# EAGLE schematic CTT-20190123 (EAGLE 6.6.0), part 1 of 2

## Sheet 1 of 12
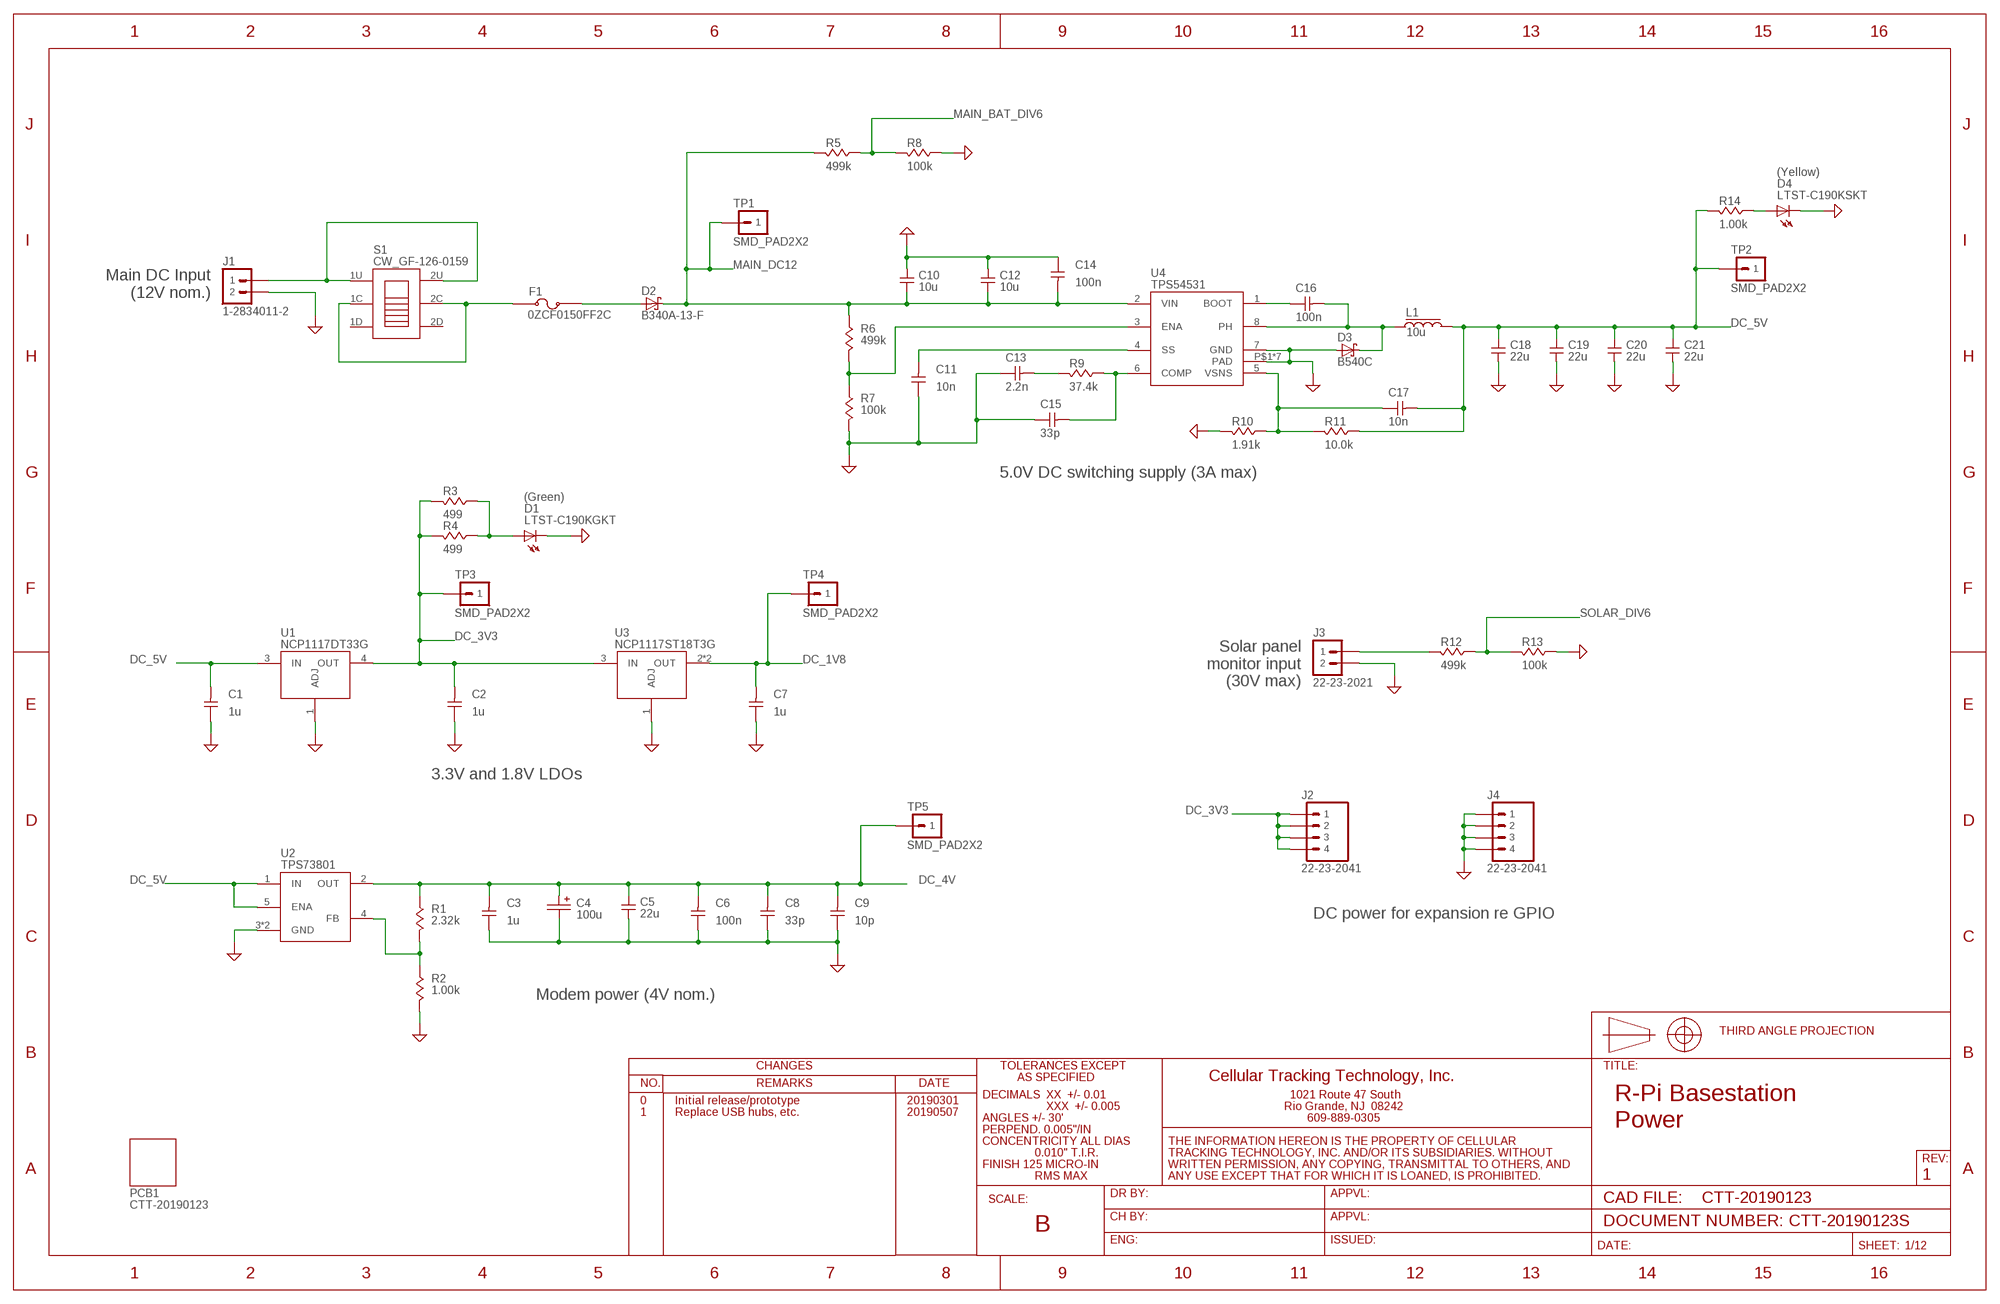
[diagram p0: schematic, sheet 1]

### Parts
C1  1u  C0603_IPC7351_MED  [C0603_IPC7351_MED]
C2  1u  C0603_IPC7351_MED  [C0603_IPC7351_MED]
C3  1u  C0603_IPC7351_MED  [C0603_IPC7351_MED]
C4  100u  CAP7343  [C7343]
C5  22u  C0805  [C0805]
C6  100n  C0402IPC_MED  [C0402_IPC7351_MED]
C7  1u  C0603_IPC7351_MED  [C0603_IPC7351_MED]
C8  33p  C0402IPC_MED  [C0402_IPC7351_MED]
C9  10p  C0402IPC_MED  [C0402_IPC7351_MED]
C10  10u  C0805  [C0805]
C11  10n  C0402IPC_MED  [C0402_IPC7351_MED]
C12  10u  C0805  [C0805]
C13  2.2n  C0402IPC_MED  [C0402_IPC7351_MED]
C14  100n  C0402IPC_MED  [C0402_IPC7351_MED]
C15  33p  C0402IPC_MED  [C0402_IPC7351_MED]
C16  100n  C0402IPC_MED  [C0402_IPC7351_MED]
C17  10n  C0402IPC_MED  [C0402_IPC7351_MED]
C18  22u  C0805  [C0805]
C19  22u  C0805  [C0805]
C20  22u  C0805  [C0805]
C21  22u  C0805  [C0805]
D1  LTST-C190KGKT  LTST-C190GKT  [LED0603]
D2  B340A-13-F  [SMA]
D3  B540C  [SMC]
D4  LTST-C190KSKT  LTST-C190GKT  [LED0603]
F1  0ZCF0150FF2C  [SMD2920_0ZCF-SERIES]
J1  1-2834011-2  [1-2834011-2]
J2  22-23-2041  640456-4  [MTA100-4]
J3  22-23-2021  640456-2  [MTA100-2]
J4  22-23-2041  640456-4  [MTA100-4]
L1  10u  SRR1260  [SRR1260]
PCB1  CTT-20190123  PCBBRD  [BLANK_BRD]
R1  2.32k  R0402MED  [R0402_IPC7351_MED]
R2  1.00k  R0402MED  [R0402_IPC7351_MED]
R3  499  R0402MED  [R0402_IPC7351_MED]
R4  499  R0402MED  [R0402_IPC7351_MED]
R5  499k  R0402MED  [R0402_IPC7351_MED]
R6  499k  R0402MED  [R0402_IPC7351_MED]
R7  100k  R0402MED  [R0402_IPC7351_MED]
R8  100k  R0402MED  [R0402_IPC7351_MED]
R9  37.4k  R0402MED  [R0402_IPC7351_MED]
R10  1.91k  R0402MED  [R0402_IPC7351_MED]
R11  10.0k  R0402MED  [R0402_IPC7351_MED]
R12  499k  R0402MED  [R0402_IPC7351_MED]
R13  100k  R0402MED  [R0402_IPC7351_MED]
R14  1.00k  R0402MED  [R0402_IPC7351_MED]
S1  CW_GF-126-0159  [CW_GF-126-0159]
TP1  SMD_PAD2X2  [SMD_PAD]
TP2  SMD_PAD2X2  [SMD_PAD]
TP3  SMD_PAD2X2  [SMD_PAD]
TP4  SMD_PAD2X2  [SMD_PAD]
TP5  SMD_PAD2X2  [SMD_PAD]
U1  NCP1117DT33G  [DPAK]
U2  TPS73801  [TI_R-PDSO-G6]
U3  NCP1117ST18T3G  [SOT-223]
U4  TPS54531  [TI_R-PDSO-G8]

### Nets
DC_1V8: C7.P$2 TP4.1 U3.2(OUT) U3.4(OUT) ; also sheet 2,4
DC_3V3: C2.P$2 J2.1 J2.2 J2.3 J2.4 R3.P$2 R4.P$2 TP3.1 U1.4(OUT) U3.3(IN) ; also sheet 2,3,4,5,6,7,8,9,10,11,12
DC_4V: C3.P$2 C4.+(POS) C5.2 C6.P$2 C8.P$2 C9.P$2 R1.P$1 TP5.1 U2.2(OUT) ; also sheet 7
DC_5V: C1.P$2 C17.P$2 C18.2 C19.2 C20.2 C21.2 L1.2 R11.P$1 R14.P$2 TP2.1 U1.3(IN) U2.1(IN) U2.5(ENA) ; also sheet 2,3,4,5,7,8,9,10,11,12
GND: C1.P$1 C2.P$1 C3.P$1 C4.-(NEG) C5.1 C6.P$1 C7.P$1 C8.P$1 C9.P$1 C10.1 C11.P$1 C12.1 C13.P$1 C14.P$1 C15.P$1 C18.1 C19.1 C20.1 C21.1 D1.K D3.A D4.K J1.2 J3.2 J4.1 J4.2 J4.3 J4.4 R2.P$2 R7.P$2 R8.P$1 R10.P$2 R13.P$1 U1.1(ADJ) U2.3(GND) U2.TAB(GND) U3.1(ADJ) U4.7(GND) U4.P$1(PAD) U4.P$2(PAD) U4.P$3(PAD) U4.P$4(PAD) U4.P$5(PAD) U4.P$6(PAD) U4.PAD ; also sheet 2,3,4,5,6,7,8,9,10,11,12
MAIN_BAT_DIV6: R5.P$1 R8.P$2 ; also sheet 3
MAIN_DC12: C10.2 C12.2 C14.P$2 D2.C R5.P$2 R6.P$1 TP1.1 U4.2(VIN)
N$1: C16.P$2 D3.K(C) L1.P$1 U4.8(PH)
N$2: R6.P$2 R7.P$1 U4.3(ENA)
N$4: C11.P$2 U4.4(SS)
N$6: C16.P$1 U4.1(BOOT)
N$7: C15.P$2 R9.P$1 U4.6(COMP)
N$8: C17.P$1 R10.P$1 R11.P$2 U4.5(VSNS)
N$9: C13.P$2 R9.P$2
N$10: J1.1 S1.1U S1.2U
N$11: D2.A F1.P$2
N$13: D4.A R14.P$1
N$14: D1.A R3.P$1 R4.P$1
N$21: R1.P$2 R2.P$1 U2.4(FB)
N$116: J3.1 R12.P$2
N$213: F1.P$1 S1.1C S1.2C
SOLAR_DIV6: R12.P$1 R13.P$2 ; also sheet 3
Unconnected: S1.1D S1.2D

### Notes on the sheet
- (Yellow)
- Main DC Input
  (12V nom.)
- 5.0V DC switching supply (3A max)
- (Green)
- Solar panel
  monitor input
  (30V max)
- 3.3V and 1.8V LDOs
- DC power for expansion re GPIO
- Modem power (4V nom.)
- 0 | Initial release/prototype | 20190301
- 1 | Replace USB hubs, etc. | 20190507
- R-Pi Basestation
  Power
- 1
- CTT-20190123S

## Sheet 2 of 12
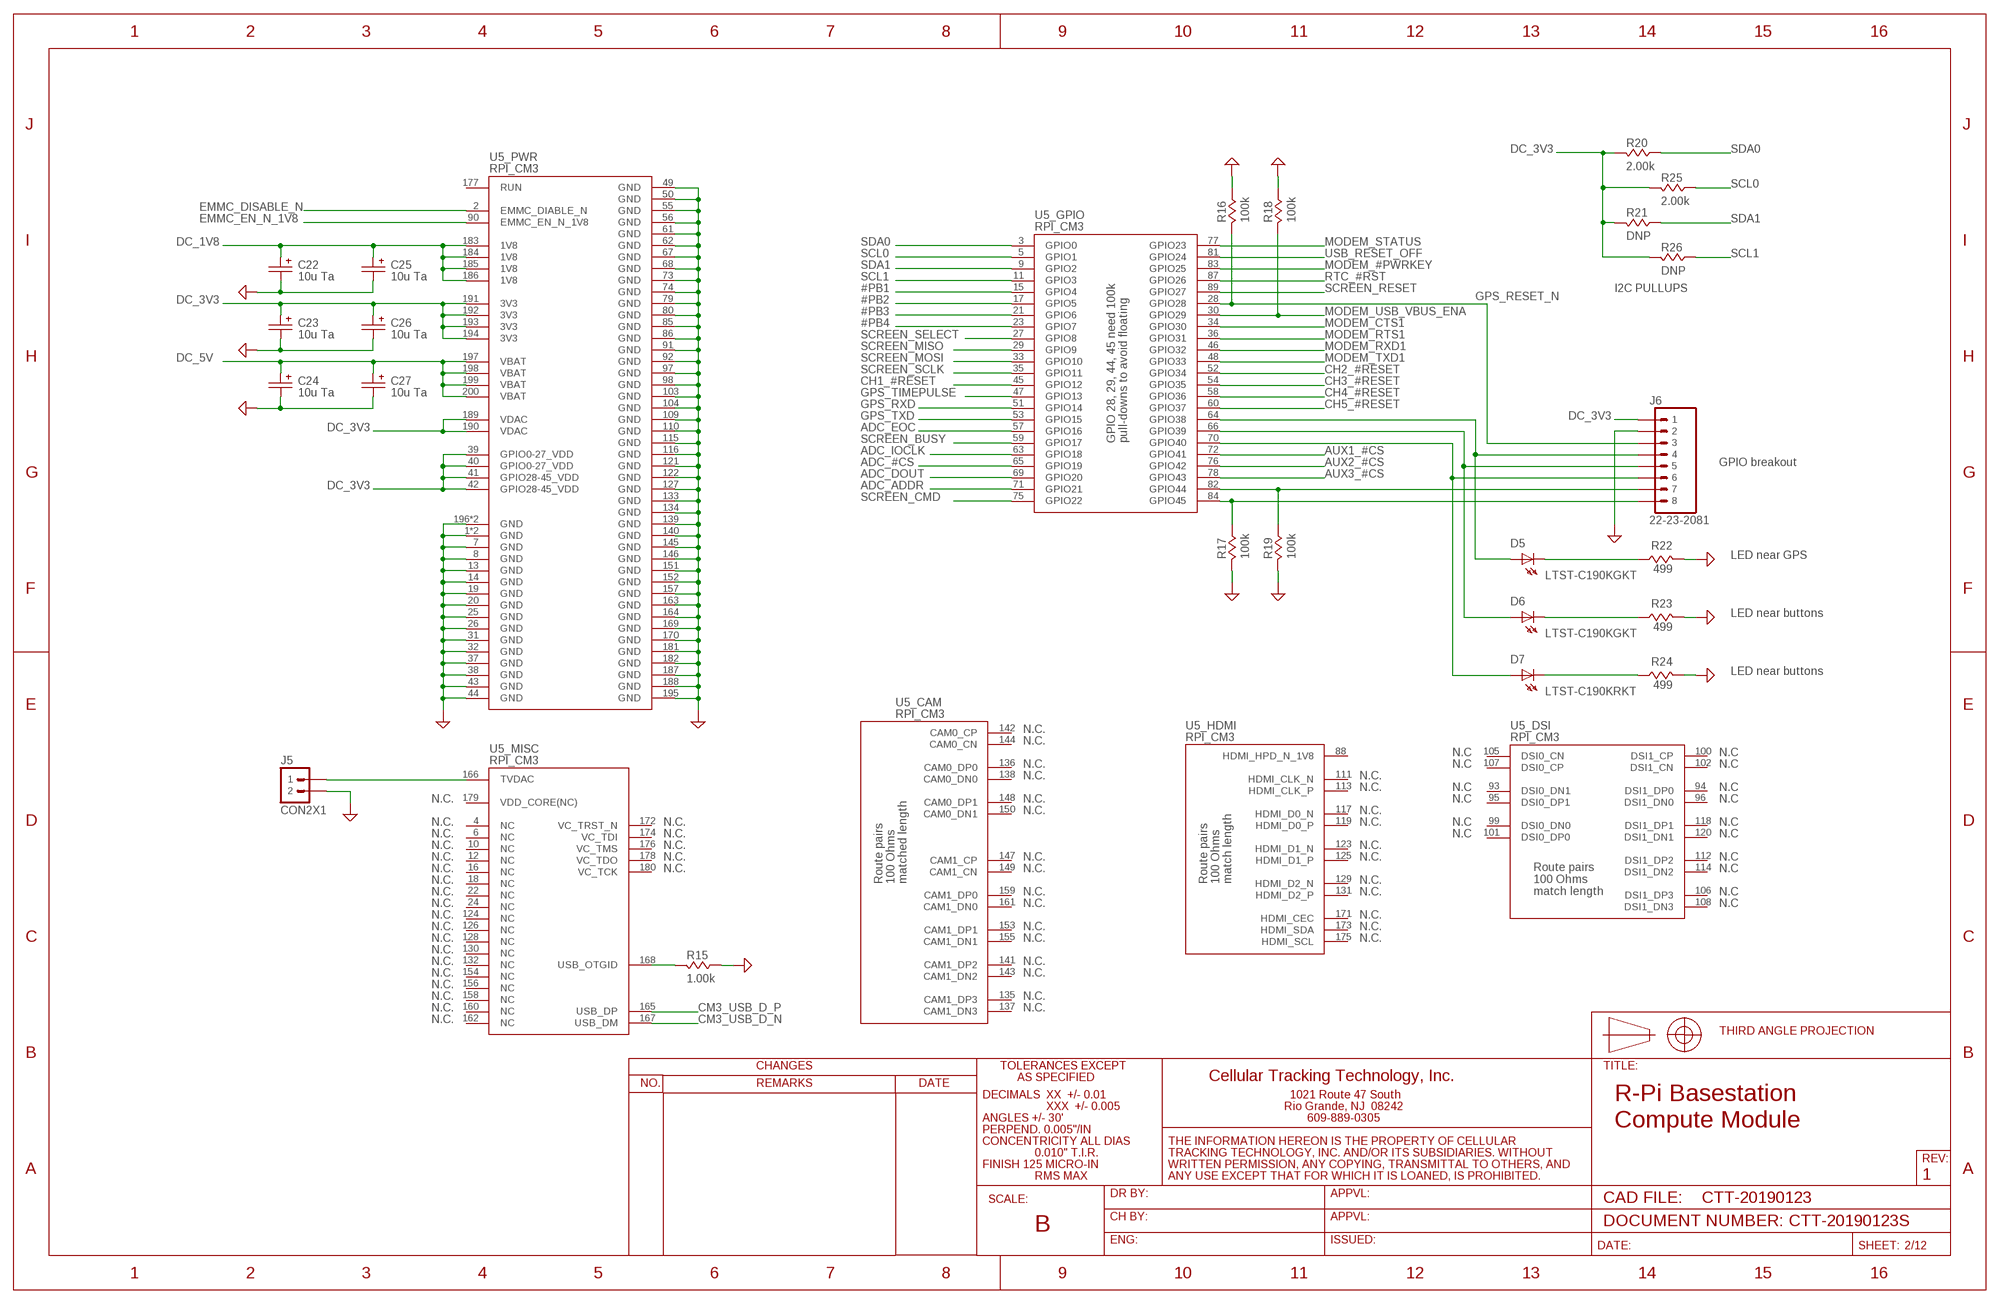
[diagram p1: schematic, sheet 2]

### Parts
C22  10u Ta  CAP1411-AVX  [CAP1411-AVX_F97SERIES]
C23  10u Ta  CAP1411-AVX  [CAP1411-AVX_F97SERIES]
C24  10u Ta  CAP1411-AVX  [CAP1411-AVX_F97SERIES]
C25  10u Ta  CAP1411-AVX  [CAP1411-AVX_F97SERIES]
C26  10u Ta  CAP1411-AVX  [CAP1411-AVX_F97SERIES]
C27  10u Ta  CAP1411-AVX  [CAP1411-AVX_F97SERIES]
D5  LTST-C190KGKT  LTST-C190GKT  [LED0603]
D6  LTST-C190KGKT  LTST-C190GKT  [LED0603]
D7  LTST-C190KRKT  LTST-C190GKT  [LED0603]
J5  CON2X1  [CON2X1]
J6  22-23-2081  640456-8  [MTA100-8]
R15  1.00k  R0402MED  [R0402_IPC7351_MED]
R16  100k  R0402MED  [R0402_IPC7351_MED]
R17  100k  R0402MED  [R0402_IPC7351_MED]
R18  100k  R0402MED  [R0402_IPC7351_MED]
R19  100k  R0402MED  [R0402_IPC7351_MED]
R20  2.00k  R0402MED  [R0402_IPC7351_MED]
R21  DNP  R0402MED  [R0402_IPC7351_MED]
R22  499  R0402MED  [R0402_IPC7351_MED]
R23  499  R0402MED  [R0402_IPC7351_MED]
R24  499  R0402MED  [R0402_IPC7351_MED]
R25  2.00k  R0402MED  [R0402_IPC7351_MED]
R26  DNP  R0402MED  [R0402_IPC7351_MED]
U5  RPI_CM3  [1473149-4]

### Nets
#PB1: U5.15(_GPIO:GPIO4) ; also sheet 3
#PB2: U5.17(_GPIO:GPIO5) ; also sheet 3
#PB3: U5.21(_GPIO:GPIO6) ; also sheet 3
#PB4: U5.23(_GPIO:GPIO7) ; also sheet 3
ADC_#CS: U5.65(_GPIO:GPIO19) ; also sheet 3
ADC_ADDR: U5.71(_GPIO:GPIO21) ; also sheet 3
ADC_DOUT: U5.69(_GPIO:GPIO20) ; also sheet 3
ADC_EOC: U5.57(_GPIO:GPIO16) ; also sheet 3
ADC_IOCLK: U5.63(_GPIO:GPIO18) ; also sheet 3
AUX1_#CS: U5.72(_GPIO:GPIO41) ; also sheet 3
AUX2_#CS: U5.76(_GPIO:GPIO42) ; also sheet 3
AUX3_#CS: U5.78(_GPIO:GPIO43) ; also sheet 3
CH1_#RESET: U5.45(_GPIO:GPIO12) ; also sheet 8
CH2_#RESET: U5.52(_GPIO:GPIO34) ; also sheet 9
CH3_#RESET: U5.54(_GPIO:GPIO35) ; also sheet 10
CH4_#RESET: U5.58(_GPIO:GPIO36) ; also sheet 11
CH5_#RESET: U5.60(_GPIO:GPIO37) ; also sheet 12
CM3_USB_D_N [USB]: U5.167(_MISC:USB_DM) ; also sheet 4
CM3_USB_D_P [USB]: U5.165(_MISC:USB_DP) ; also sheet 4
DC_1V8: C22.+(POS) C25.+(POS) U5.183(_PWR:1V8) U5.184(_PWR:1V8) U5.185(_PWR:1V8) U5.186(_PWR:1V8) ; also sheet 1,4
DC_3V3: C23.+(POS) C26.+(POS) J6.1 R20.P$2 R21.P$2 R25.P$2 R26.P$2 U5.39(_PWR:GPIO0-27_VDD) U5.40(_PWR:GPIO0-27_VDD) U5.41(_PWR:GPIO28-45_VDD) U5.42(_PWR:GPIO28-45_VDD) U5.189(_PWR:VDAC) U5.190(_PWR:VDAC) U5.191(_PWR:3V3) U5.192(_PWR:3V3) U5.193(_PWR:3V3) U5.194(_PWR:3V3) ; also sheet 1,3,4,5,6,7,8,9,10,11,12
DC_5V: C24.+(POS) C27.+(POS) U5.197(_PWR:VBAT) U5.198(_PWR:VBAT) U5.199(_PWR:VBAT) U5.200(_PWR:VBAT) ; also sheet 1,3,4,5,7,8,9,10,11,12
EMMC_DISABLE_N: U5.2(_PWR:EMMC_DIABLE_N) ; also sheet 4
EMMC_EN_N_1V8: U5.90(_PWR:EMMC_EN_N_1V8) ; also sheet 4
GND: C22.-(NEG) C23.-(NEG) C24.-(NEG) C25.-(NEG) C26.-(NEG) C27.-(NEG) J5.2 J6.2 R15.P$1 R16.P$1 R17.P$2 R18.P$1 R19.P$2 R22.P$2 R23.P$2 R24.P$2 U5.1(_PWR:GND) U5.7(_PWR:GND) U5.8(_PWR:GND) U5.13(_PWR:GND) U5.14(_PWR:GND) U5.19(_PWR:GND) U5.20(_PWR:GND) U5.25(_PWR:GND) U5.26(_PWR:GND) U5.31(_PWR:GND) U5.32(_PWR:GND) U5.37(_PWR:GND) U5.38(_PWR:GND) U5.43(_PWR:GND) U5.44(_PWR:GND) U5.49(_PWR:GND) U5.50(_PWR:GND) U5.55(_PWR:GND) U5.56(_PWR:GND) U5.61(_PWR:GND) U5.62(_PWR:GND) U5.67(_PWR:GND) U5.68(_PWR:GND) U5.73(_PWR:GND) U5.74(_PWR:GND) U5.79(_PWR:GND) U5.80(_PWR:GND) U5.85(_PWR:GND) U5.86(_PWR:GND) U5.91(_PWR:GND) U5.92(_PWR:GND) U5.97(_PWR:GND) U5.98(_PWR:GND) U5.103(_PWR:GND) U5.104(_PWR:GND) U5.109(_PWR:GND) U5.110(_PWR:GND) U5.115(_PWR:GND) U5.116(_PWR:GND) U5.121(_PWR:GND) U5.122(_PWR:GND) U5.127(_PWR:GND) U5.133(_PWR:GND) U5.134(_PWR:GND) U5.139(_PWR:GND) U5.140(_PWR:GND) U5.145(_PWR:GND) U5.146(_PWR:GND) U5.151(_PWR:GND) U5.152(_PWR:GND) U5.157(_PWR:GND) U5.163(_PWR:GND) U5.164(_PWR:GND) U5.169(_PWR:GND) U5.170(_PWR:GND) U5.181(_PWR:GND) U5.182(_PWR:GND) U5.187(_PWR:GND) U5.188(_PWR:GND) U5.195(_PWR:GND) U5.196(_PWR:GND) U5.P$1(_PWR:GND) U5.P$2(_PWR:GND) ; also sheet 1,3,4,5,6,7,8,9,10,11,12
GPS_RESET_N: J6.3 R16.P$2 U5.28(_GPIO:GPIO28) ; also sheet 3
GPS_RXD: U5.51(_GPIO:GPIO14) ; also sheet 3
GPS_TIMEPULSE: U5.47(_GPIO:GPIO13) ; also sheet 3
GPS_TXD: U5.53(_GPIO:GPIO15) ; also sheet 3
MODEM_#PWRKEY: U5.83(_GPIO:GPIO25) ; also sheet 3,7
MODEM_CTS1: U5.34(_GPIO:GPIO30) ; also sheet 7
MODEM_RTS1: U5.36(_GPIO:GPIO31) ; also sheet 7
MODEM_RXD1: U5.46(_GPIO:GPIO32) ; also sheet 7
MODEM_STATUS: U5.77(_GPIO:GPIO23) ; also sheet 7
MODEM_TXD1: U5.48(_GPIO:GPIO33) ; also sheet 7
MODEM_USB_VBUS_ENA: R18.P$2 U5.30(_GPIO:GPIO29) ; also sheet 7
N$15: J5.1 U5.166(_MISC:TVDAC)
N$16: R15.P$2 U5.168(_MISC:USB_OTGID)
N$108: J6.8 R17.P$1 U5.84(_GPIO:GPIO45)
N$110: J6.7 R19.P$1 U5.82(_GPIO:GPIO44)
N$168: D5.A J6.4 U5.64(_GPIO:GPIO38)
N$169: D6.A J6.5 U5.66(_GPIO:GPIO39)
N$170: D7.A J6.6 U5.70(_GPIO:GPIO40)
N$222: D6.K R23.P$1
N$224: D7.K R24.P$1
N$239: D5.K R22.P$1
RTC_#RST: U5.87(_GPIO:GPIO26) ; also sheet 3
SCL0: R25.P$1 U5.5(_GPIO:GPIO1) ; also sheet 3
SCL1: R26.P$1 U5.11(_GPIO:GPIO3) ; also sheet 3
SCREEN_BUSY: U5.59(_GPIO:GPIO17) ; also sheet 3
SCREEN_CMD: U5.75(_GPIO:GPIO22) ; also sheet 3
SCREEN_MISO: U5.29(_GPIO:GPIO9) ; also sheet 3
SCREEN_MOSI: U5.33(_GPIO:GPIO10) ; also sheet 3
SCREEN_RESET: U5.89(_GPIO:GPIO27) ; also sheet 3
SCREEN_SCLK: U5.35(_GPIO:GPIO11) ; also sheet 3
SCREEN_SELECT: U5.27(_GPIO:GPIO8) ; also sheet 3
SDA0: R20.P$1 U5.3(_GPIO:GPIO0) ; also sheet 3
SDA1: R21.P$1 U5.9(_GPIO:GPIO2) ; also sheet 3
USB_RESET_OFF: U5.81(_GPIO:GPIO24) ; also sheet 4
Unconnected: U5.4(_MISC:NC) U5.6(_MISC:NC) U5.10(_MISC:NC) U5.12(_MISC:NC) U5.16(_MISC:NC) U5.18(_MISC:NC) U5.22(_MISC:NC) U5.24(_MISC:NC) U5.88(_HDMI:HDMI_HPD_N_1V8) U5.93(_DSI:DSI0_DN1) U5.94(_DSI:DSI1_DP0) U5.95(_DSI:DSI0_DP1) U5.96(_DSI:DSI1_DN0) U5.99(_DSI:DSI0_DN0) U5.100(_DSI:DSI1_CP) U5.101(_DSI:DSI0_DP0) U5.102(_DSI:DSI1_CN) U5.105(_DSI:DSI0_CN) U5.106(_DSI:DSI1_DP3) U5.107(_DSI:DSI0_CP) U5.108(_DSI:DSI1_DN3) U5.111(_HDMI:HDMI_CLK_N) U5.112(_DSI:DSI1_DP2) U5.113(_HDMI:HDMI_CLK_P) U5.114(_DSI:DSI1_DN2) U5.117(_HDMI:HDMI_D0_N) U5.118(_DSI:DSI1_DP1) U5.119(_HDMI:HDMI_D0_P) U5.120(_DSI:DSI1_DN1) U5.123(_HDMI:HDMI_D1_N) U5.124(_MISC:NC) U5.125(_HDMI:HDMI_D1_P) U5.126(_MISC:NC) U5.128(_MISC:NC) U5.129(_HDMI:HDMI_D2_N) U5.130(_MISC:NC) U5.131(_HDMI:HDMI_D2_P) U5.132(_MISC:NC) U5.135(_CAM:CAM1_DP3) U5.136(_CAM:CAM0_DP0) U5.137(_CAM:CAM1_DN3) U5.138(_CAM:CAM0_DN0) U5.141(_CAM:CAM1_DP2) U5.142(_CAM:CAM0_CP) U5.143(_CAM:CAM1_DN2) U5.144(_CAM:CAM0_CN) U5.147(_CAM:CAM1_CP) U5.148(_CAM:CAM0_DP1) U5.149(_CAM:CAM1_CN) U5.150(_CAM:CAM0_DN1) U5.153(_CAM:CAM1_DP1) U5.154(_MISC:NC) U5.155(_CAM:CAM1_DN1) U5.156(_MISC:NC) U5.158(_MISC:NC) U5.159(_CAM:CAM1_DP0) U5.160(_MISC:NC) U5.161(_CAM:CAM1_DN0) U5.162(_MISC:NC) U5.171(_HDMI:HDMI_CEC) U5.172(_MISC:VC_TRST_N) U5.173(_HDMI:HDMI_SDA) U5.174(_MISC:VC_TDI) U5.175(_HDMI:HDMI_SCL) U5.176(_MISC:VC_TMS) U5.177(_PWR:RUN) U5.178(_MISC:VC_TDO) U5.179(_MISC:VDD_CORE(NC)) U5.180(_MISC:VC_TCK)

### Notes on the sheet
- I2C PULLUPS
- GPIO breakout
- LED near GPS
- LED near buttons
- LED near buttons
- N.C.
- N.C.
- N.C | N.C
- N.C. | N.C | N.C
- N.C. | N.C.
- N.C. | N.C | N.C
- N.C. | N.C. | N.C | N.C
- N.C. | N.C.
- N.C. | N.C. | N.C. | N.C | N.C
- N.C. | N.C. | N.C | N.C
- N.C. | N.C. | N.C.
- N.C. | N.C. | N.C. | N.C. | N.C
- N.C. | N.C. | N.C. | N.C
- N.C. | N.C.
- N.C. | N.C. | N.C. | N.C
- N.C. | N.C. | N.C
- N.C. | N.C.
- N.C. | N.C. | N.C.
- N.C. | N.C. | N.C.
- N.C.
- N.C. | N.C.
- N.C. | N.C.
- N.C.
- N.C. | N.C.
- N.C. | N.C.
- N.C.
- R-Pi Basestation
  Compute Module
- 1
- CTT-20190123S

## Sheet 3 of 12
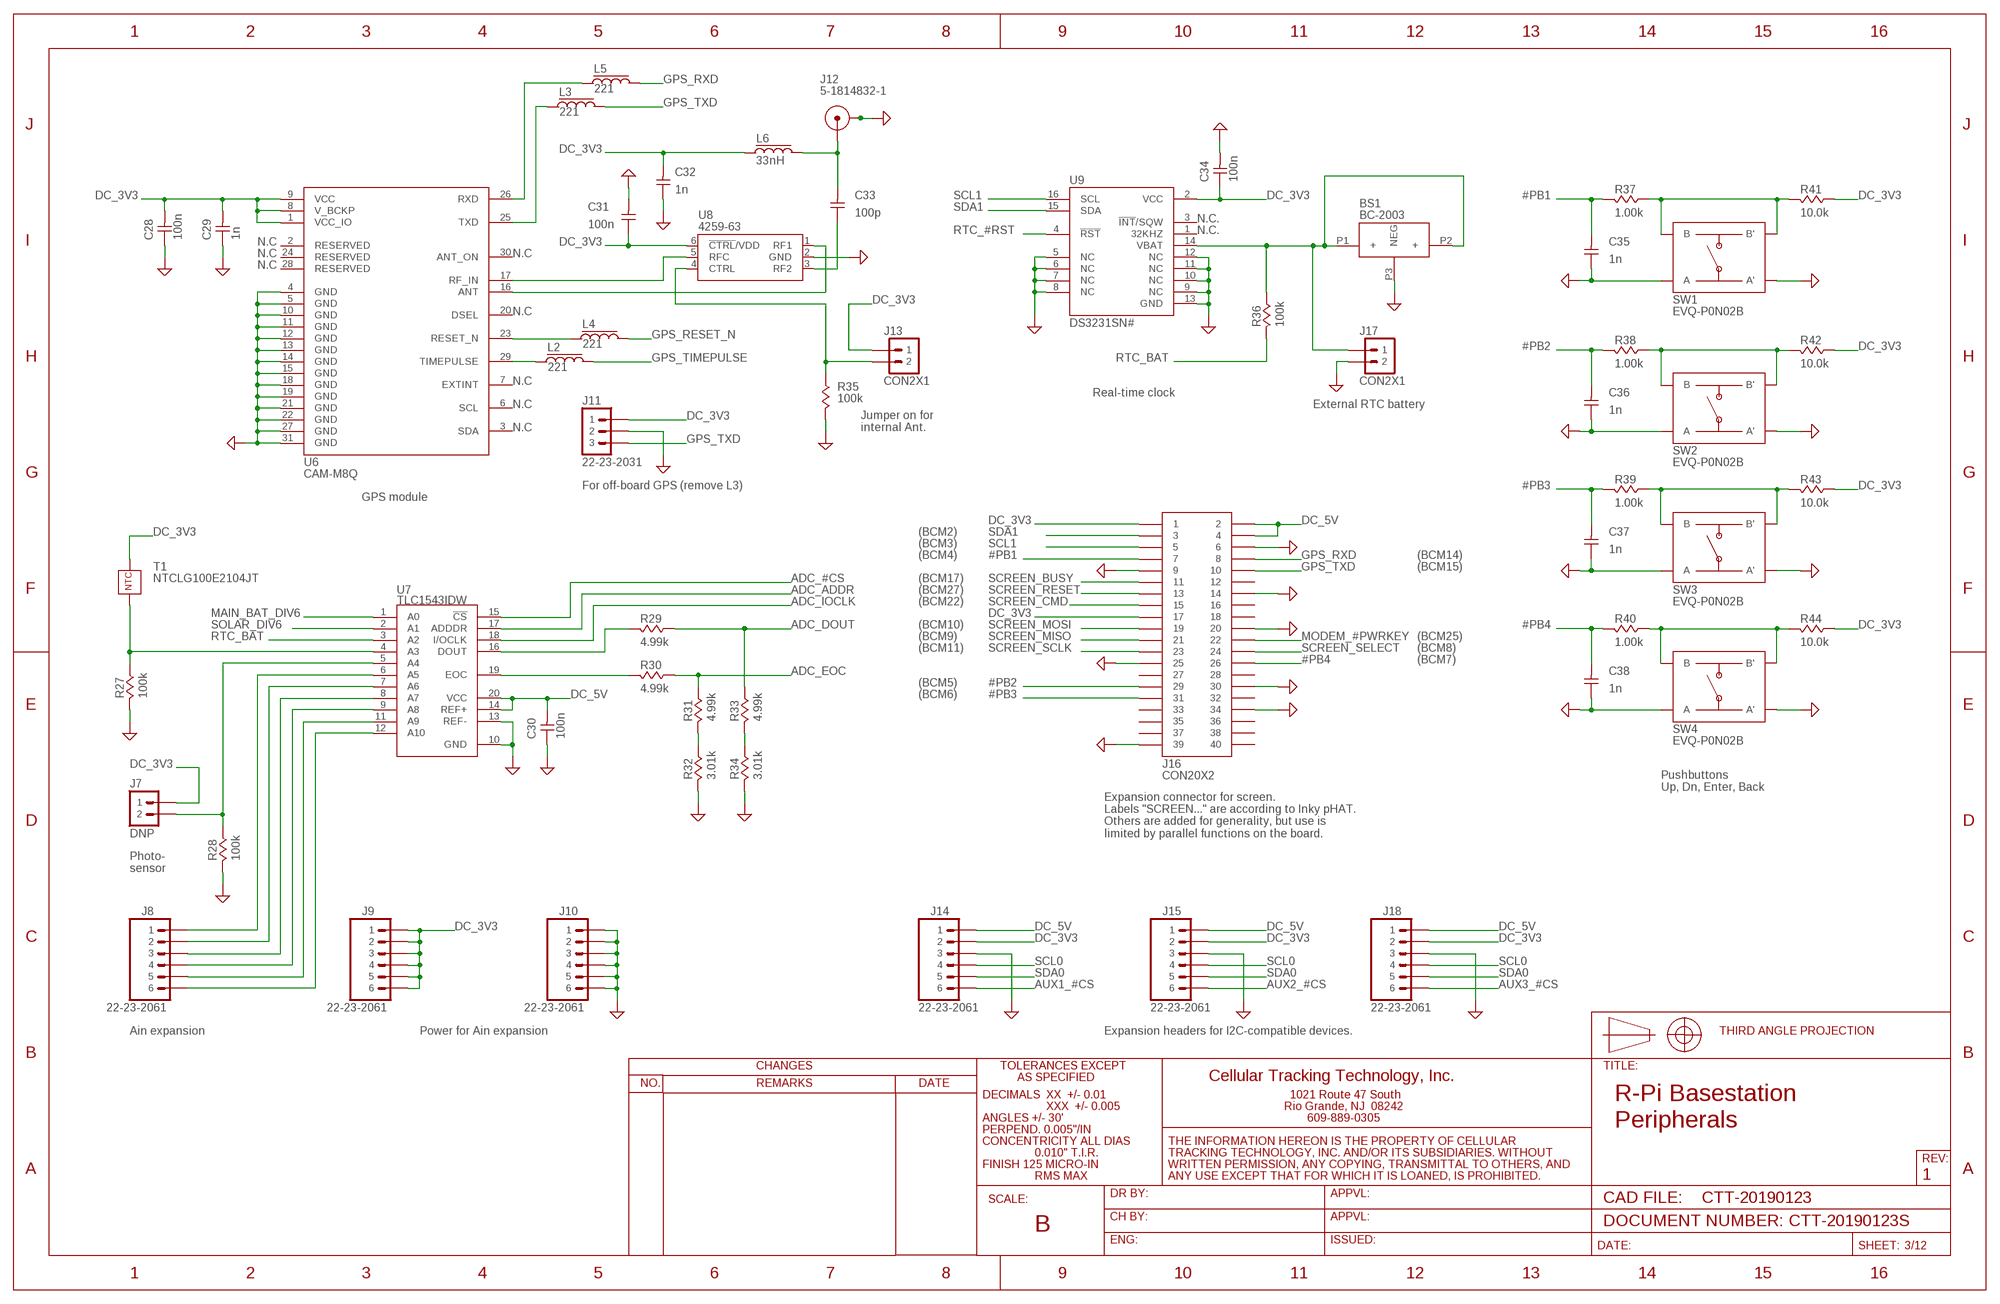
[diagram p2: schematic, sheet 3]

### Parts
BS1  BC-2003  [BC-2003-TR]
C28  100n  C0402IPC_MED  [C0402_IPC7351_MED]
C29  1n  C0402IPC_MED  [C0402_IPC7351_MED]
C30  100n  C0402IPC_MED  [C0402_IPC7351_MED]
C31  100n  C0402IPC_MED  [C0402_IPC7351_MED]
C32  1n  C0402IPC_MED  [C0402_IPC7351_MED]
C33  100p  C0402IPC_MED  [C0402_IPC7351_MED]
C34  100n  C0402IPC_MED  [C0402_IPC7351_MED]
C35  1n  C0402IPC_MED  [C0402_IPC7351_MED]
C36  1n  C0402IPC_MED  [C0402_IPC7351_MED]
C37  1n  C0402IPC_MED  [C0402_IPC7351_MED]
C38  1n  C0402IPC_MED  [C0402_IPC7351_MED]
J7  DNP  CON2X1  [CON2X1]
J8  22-23-2061  640456-6  [MTA100-6]
J9  22-23-2061  640456-6  [MTA100-6]
J10  22-23-2061  640456-6  [MTA100-6]
J11  22-23-2031  640456-3  [MTA100-3]
J12  5-1814832-1  CON_COAXSMA_TH_VERT  [CON_SMA_TH_VERT]
J13  CON2X1  [CON2X1]
J14  22-23-2061  640456-6  [MTA100-6]
J15  22-23-2061  640456-6  [MTA100-6]
J16  CON20X2  [CON20X2]
J17  CON2X1  [CON2X1]
J18  22-23-2061  640456-6  [MTA100-6]
L2  221  L0402  [L0402_IPC7351_MED]
L3  221  L0402  [L0402_IPC7351_MED]
L4  221  L0402  [L0402_IPC7351_MED]
L5  221  L0402  [L0402_IPC7351_MED]
L6  33nH  L0402  [L0402_IPC7351_MED]
R27  100k  R0402MED  [R0402_IPC7351_MED]
R28  100k  R0402MED  [R0402_IPC7351_MED]
R29  4.99k  R0402MED  [R0402_IPC7351_MED]
R30  4.99k  R0402MED  [R0402_IPC7351_MED]
R31  4.99k  R0402MED  [R0402_IPC7351_MED]
R32  3.01k  R0402MED  [R0402_IPC7351_MED]
R33  4.99k  R0402MED  [R0402_IPC7351_MED]
R34  3.01k  R0402MED  [R0402_IPC7351_MED]
R35  100k  R0402MED  [R0402_IPC7351_MED]
R36  100k  R0402MED  [R0402_IPC7351_MED]
R37  1.00k  R0402MED  [R0402_IPC7351_MED]
R38  1.00k  R0402MED  [R0402_IPC7351_MED]
R39  1.00k  R0402MED  [R0402_IPC7351_MED]
R40  1.00k  R0402MED  [R0402_IPC7351_MED]
R41  10.0k  R0402MED  [R0402_IPC7351_MED]
R42  10.0k  R0402MED  [R0402_IPC7351_MED]
R43  10.0k  R0402MED  [R0402_IPC7351_MED]
R44  10.0k  R0402MED  [R0402_IPC7351_MED]
SW1  EVQ-P0N02B  EVQ-P00  [EVQP0]
SW2  EVQ-P0N02B  EVQ-P00  [EVQP0]
SW3  EVQ-P0N02B  EVQ-P00  [EVQP0]
SW4  EVQ-P0N02B  EVQ-P00  [EVQP0]
T1  NTCLG100E2104JT  [DO35-VERT]
U6  CAM-M8Q  [LCC31]
U7  TLC1543IDW  [SOIC20_DW0020A]
U8  4259-63  [SC-70_PEREGRINE]
U9  DS3231SN#  [SO16-WIDE_MAXIM]

### Nets
#PB1: C35.P$2 J16.7 R37.P$2 ; also sheet 2
#PB2: C36.P$2 J16.29 R38.P$2 ; also sheet 2
#PB3: C37.P$2 J16.31 R39.P$2 ; also sheet 2
#PB4: C38.P$2 J16.26 R40.P$2 ; also sheet 2
ADC_#CS: U7.15(!CS) ; also sheet 2
ADC_ADDR: U7.17(ADDDR) ; also sheet 2
ADC_DOUT: R29.P$1 R33.P$1 ; also sheet 2
ADC_EOC: R30.P$1 R31.P$1 ; also sheet 2
ADC_IOCLK: U7.18(I/OCLK) ; also sheet 2
AUX1_#CS: J14.6 ; also sheet 2
AUX2_#CS: J15.6 ; also sheet 2
AUX3_#CS: J18.6 ; also sheet 2
DC_3V3: C28.P$2 C29.P$2 C31.P$1 C32.P$2 C34.P$1 J7.1 J9.1 J9.2 J9.3 J9.4 J9.5 J9.6 J11.1 J13.1 J14.2 J15.2 J16.1 J16.17 J18.2 L6.P$1 R41.P$1 R42.P$1 R43.P$1 R44.P$1 T1.P$1 U6.1(VCC_IO) U6.8(V_BCKP) U6.9(VCC) U8.6(!CTRL!/VDD) U9.2(VCC) ; also sheet 1,2,4,5,6,7,8,9,10,11,12
DC_5V: C30.P$2 J14.1 J15.1 J16.2 J16.4 J18.1 U7.14(REF+) U7.20(VCC) ; also sheet 1,2,4,5,7,8,9,10,11,12
GND: BS1.P3(NEG) C28.P$1 C29.P$1 C30.P$1 C31.P$2 C32.P$1 C34.P$2 C35.P$1 C36.P$1 C37.P$1 C38.P$1 J10.1 J10.2 J10.3 J10.4 J10.5 J10.6 J11.2 J12.P$1(GND) J12.P$2(GND) J12.P$3(GND) J12.P$4(GND) J14.3 J15.3 J16.6 J16.9 J16.14 J16.20 J16.25 J16.30 J16.34 J16.39 J17.2 J18.3 R27.P$2 R28.P$2 R32.P$2 R34.P$2 R35.P$2 SW1.A SW1.A@1(A') SW2.A SW2.A@1(A') SW3.A SW3.A@1(A') SW4.A SW4.A@1(A') U6.4(GND) U6.5(GND) U6.10(GND) U6.11(GND) U6.12(GND) U6.13(GND) U6.14(GND) U6.15(GND) U6.18(GND) U6.19(GND) U6.21(GND) U6.22(GND) U6.27(GND) U6.31(GND) U7.10(GND) U7.13(REF-) U8.2(GND) U9.5(NC) U9.6(NC) U9.7(NC) U9.8(NC) U9.9(NC) U9.10(NC) U9.11(NC) U9.12(NC) U9.13(GND) ; also sheet 1,2,4,5,6,7,8,9,10,11,12
GPS_RESET_N: L4.P$2 ; also sheet 2
GPS_RXD: J16.8 L5.P$2 ; also sheet 2
GPS_TIMEPULSE: L2.P$2 ; also sheet 2
GPS_TXD: J11.3 J16.10 L3.P$2 ; also sheet 2
MAIN_BAT_DIV6: U7.1(A0) ; also sheet 1
MODEM_#PWRKEY: J16.22 ; also sheet 2,7
N$12: C33.P$2 J12.C(SIG) L6.P$2
N$18: U6.17(RF_IN) U8.5(RFC)
N$40: C33.P$1 U8.3(RF2)
N$46: U6.16(ANT) U8.1(RF1)
N$103: L4.P$1 U6.23(RESET_N)
N$107: L5.P$1 U6.26(RXD)
N$109: L3.P$1 U6.25(TXD)
N$111: L2.P$1 U6.29(TIMEPULSE)
N$114: BS1.P1(+) BS1.P2(+) J17.1 R36.P$1 U9.14(VBAT)
N$115: R30.P$2 U7.19(EOC)
N$117: R29.P$2 U7.16(DOUT)
N$118: J7.2 R28.P$1 U7.5(A4)
N$119: R31.P$2 R32.P$1
N$120: R33.P$2 R34.P$1
N$121: R27.P$1 T1.P$2 U7.4(A3)
N$122: J8.1 U7.6(A5)
N$123: J8.2 U7.7(A6)
N$124: J8.3 U7.8(A7)
N$125: J8.4 U7.9(A8)
N$126: J8.5 U7.11(A9)
N$127: J8.6 U7.12(A10)
N$129: R40.P$1 R44.P$2 SW4.B SW4.B@1(B')
N$132: R39.P$1 R43.P$2 SW3.B SW3.B@1(B')
N$134: R38.P$1 R42.P$2 SW2.B SW2.B@1(B')
N$138: R37.P$1 R41.P$2 SW1.B SW1.B@1(B')
N$238: J13.2 R35.P$1 U8.4(CTRL)
RTC_#RST: U9.4(!RST) ; also sheet 2
RTC_BAT: R36.P$2 U7.3(A2)
SCL0: J14.4 J15.4 J18.4 ; also sheet 2
SCL1: J16.5 U9.16(SCL) ; also sheet 2
SCREEN_BUSY: J16.11 ; also sheet 2
SCREEN_CMD: J16.15 ; also sheet 2
SCREEN_MISO: J16.21 ; also sheet 2
SCREEN_MOSI: J16.19 ; also sheet 2
SCREEN_RESET: J16.13 ; also sheet 2
SCREEN_SCLK: J16.23 ; also sheet 2
SCREEN_SELECT: J16.24 ; also sheet 2
SDA0: J14.5 J15.5 J18.5 ; also sheet 2
SDA1: J16.3 U9.15(SDA) ; also sheet 2
SOLAR_DIV6: U7.2(A1) ; also sheet 1
Unconnected: J16.12 J16.16 J16.18 J16.27 J16.28 J16.32 J16.33 J16.35 J16.36 J16.37 J16.38 J16.40 U6.2(RESERVED) U6.3(SDA) U6.6(SCL) U6.7(EXTINT) U6.20(DSEL) U6.24(RESERVED) U6.28(RESERVED) U6.30(ANT_ON) U9.1(32KHZ) U9.3(!INT!/SQW)

### Notes on the sheet
- N.C.
- N.C.
- N.C
- N.C | N.C
- N.C
- N.C
- N.C
- Real-time clock
- N.C | External RTC battery
- N.C
- Jumper on for
  internal Ant.
- For off-board GPS (remove L3)
- GPS module
- (BCM2)
- (BCM3)
- (BCM4) | (BCM14)
- (BCM15)
- (BCM17)
- (BCM27)
- (BCM22)
- (BCM10)
- (BCM9) | (BCM25)
- (BCM11) | (BCM8)
- (BCM7)
- (BCM5)
- (BCM6)
- Pushbuttons
  Up, Dn, Enter, Back
- Expansion connector for screen.
  Labels "SCREEN..." are according to Inky pHAT.
  Others are added for generality, but use is 
  limited by parallel functions on the board.
- Photo-
  sensor
- Ain expansion | Power for Ain expansion | Expansion headers for I2C-compatible devices.
- R-Pi Basestation
  Peripherals
- 1
- CTT-20190123S

## Sheet 4 of 12
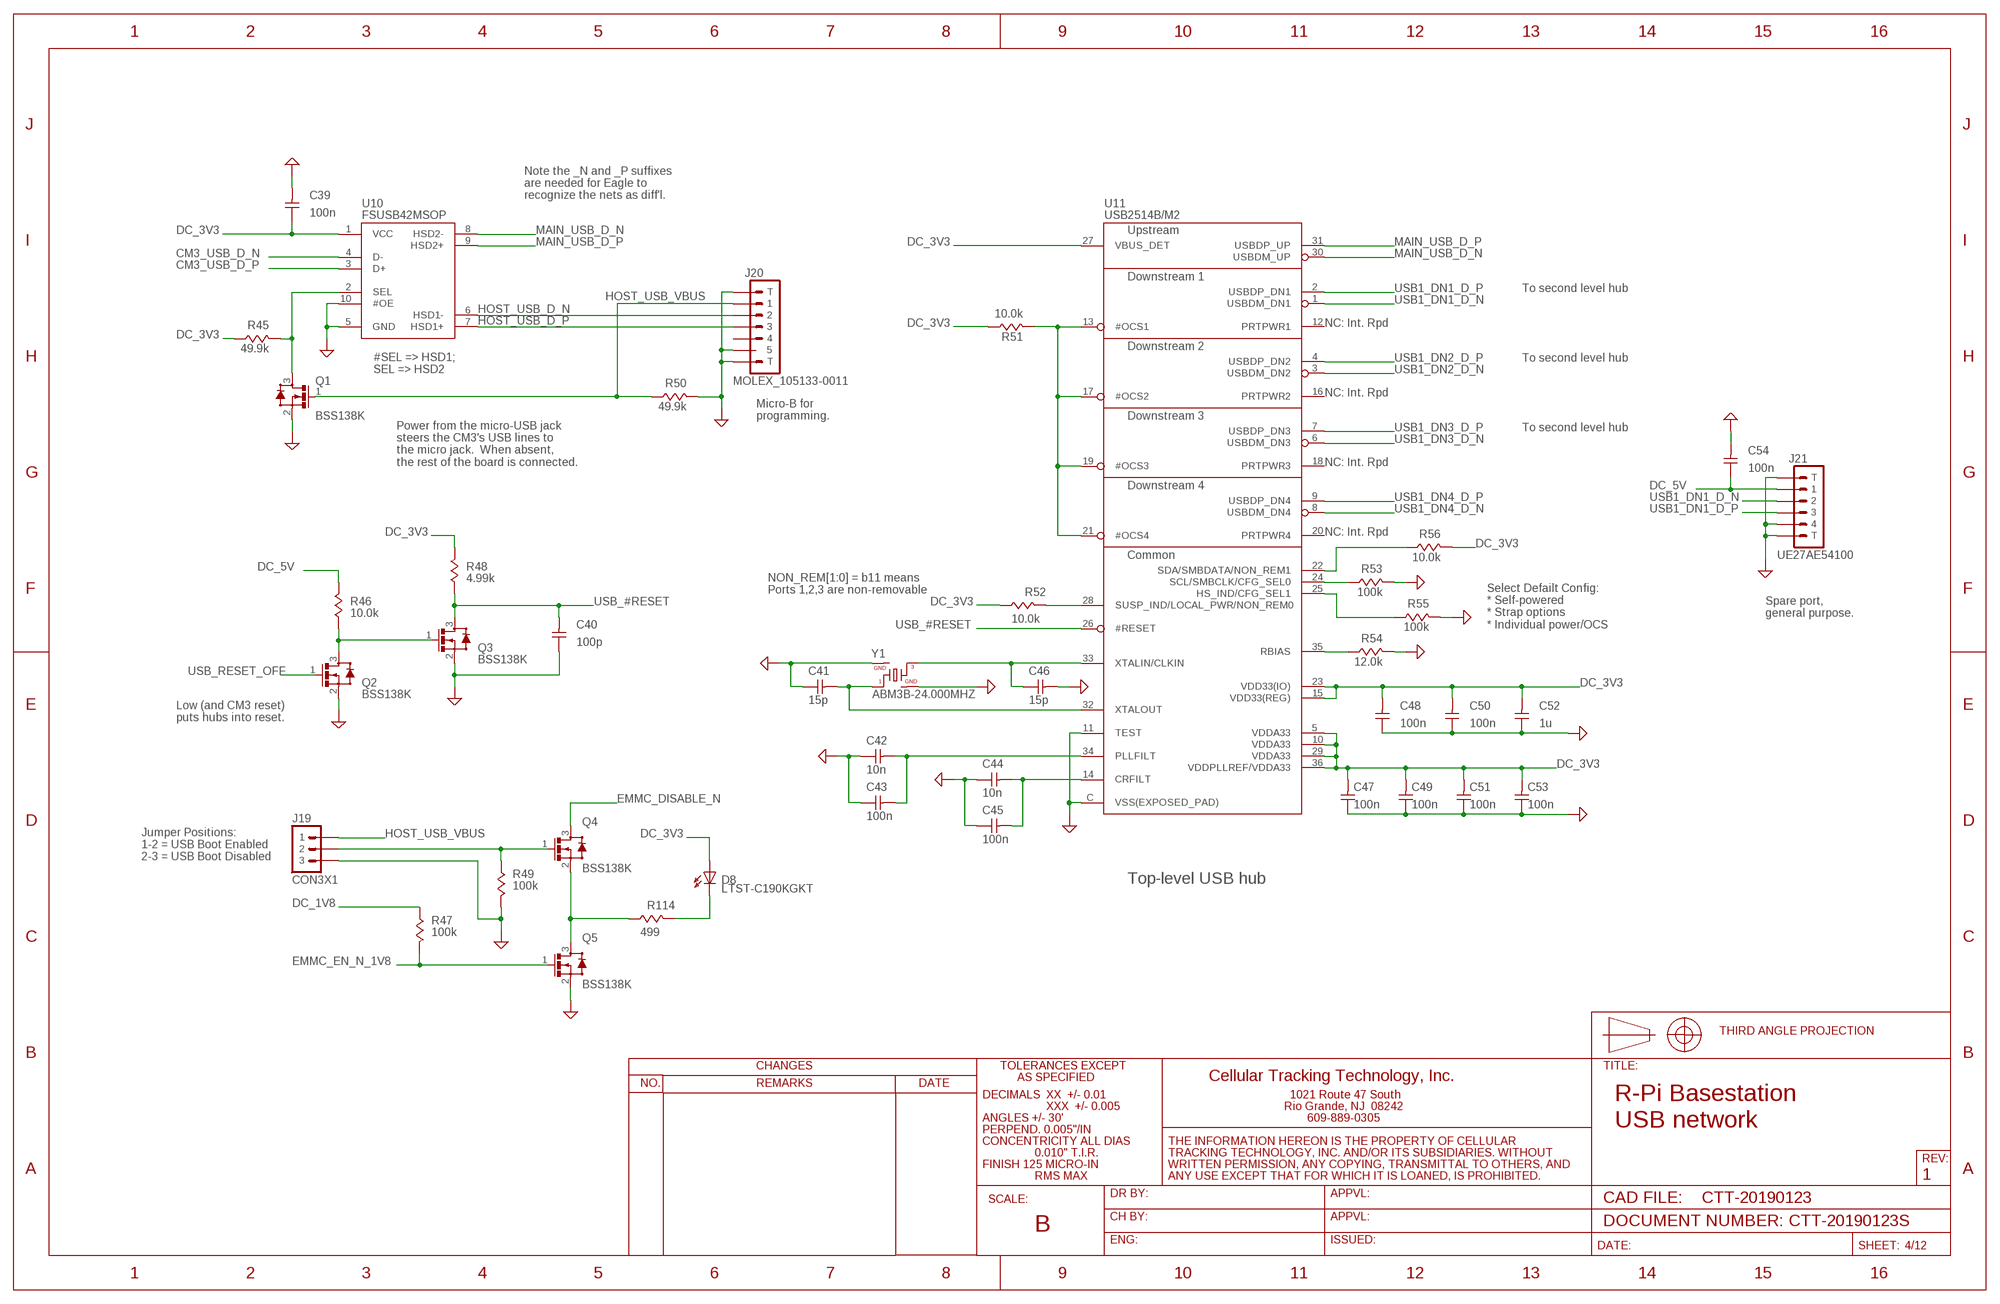
[diagram p3: schematic, sheet 4]

### Parts
C39  100n  C0402IPC_MED  [C0402_IPC7351_MED]
C40  100p  C0402IPC_MED  [C0402_IPC7351_MED]
C41  15p  C0402IPC_MED  [C0402_IPC7351_MED]
C42  10n  C0402IPC_MED  [C0402_IPC7351_MED]
C43  100n  C0402IPC_MED  [C0402_IPC7351_MED]
C44  10n  C0402IPC_MED  [C0402_IPC7351_MED]
C45  100n  C0402IPC_MED  [C0402_IPC7351_MED]
C46  15p  C0402IPC_MED  [C0402_IPC7351_MED]
C47  100n  C0402IPC_MED  [C0402_IPC7351_MED]
C48  100n  C0402IPC_MED  [C0402_IPC7351_MED]
C49  100n  C0402IPC_MED  [C0402_IPC7351_MED]
C50  100n  C0402IPC_MED  [C0402_IPC7351_MED]
C51  100n  C0402IPC_MED  [C0402_IPC7351_MED]
C52  1u  C0603_IPC7351_MED  [C0603_IPC7351_MED]
C53  100n  C0402IPC_MED  [C0402_IPC7351_MED]
C54  100n  C0402IPC_MED  [C0402_IPC7351_MED]
D8  LTST-C190KGKT  LTST-C190GKT  [LED0603]
J19  CON3X1  [CON3X1]
J20  MOLEX_105133-0011  [MOLEX_105133-0011]
J21  UE27AE54100  [UE27AE54100]
Q1  BSS138K  BSS138  [SOT-23]
Q2  BSS138K  BSS138  [SOT-23]
Q3  BSS138K  BSS138  [SOT-23]
Q4  BSS138K  BSS138  [SOT-23]
Q5  BSS138K  BSS138  [SOT-23]
R45  49.9k  R0402MED  [R0402_IPC7351_MED]
R46  10.0k  R0402MED  [R0402_IPC7351_MED]
R47  100k  R0402MED  [R0402_IPC7351_MED]
R48  4.99k  R0402MED  [R0402_IPC7351_MED]
R49  100k  R0402MED  [R0402_IPC7351_MED]
R50  49.9k  R0402MED  [R0402_IPC7351_MED]
R51  10.0k  R0402MED  [R0402_IPC7351_MED]
R52  10.0k  R0402MED  [R0402_IPC7351_MED]
R53  100k  R0402MED  [R0402_IPC7351_MED]
R54  12.0k  R0402MED  [R0402_IPC7351_MED]
R55  100k  R0402MED  [R0402_IPC7351_MED]
R56  10.0k  R0402MED  [R0402_IPC7351_MED]
R114  499  R0402MED  [R0402_IPC7351_MED]
U10  FSUSB42MSOP  [MSOP-10]
U11  USB2514B/M2  [SQFN-36]
Y1  ABM3B-24.000MHZ  ABM3B-8.000MHZB2T  [ABM3B]

### Nets
CM3_USB_D_N [USB]: U10.4(D-) ; also sheet 2
CM3_USB_D_P [USB]: U10.3(D+) ; also sheet 2
DC_1V8: R47.P$1 ; also sheet 1,2
DC_3V3: C39.P$1 C47.P$2 C48.P$2 C49.P$2 C50.P$2 C51.P$2 C52.P$2 C53.P$2 D8.A R45.P$1 R48.P$2 R51.P$1 R52.P$1 R56.P$2 U10.1(VCC) U11.5(VDDA33) U11.10(VDDA33) U11.15(VDD33(REG)) U11.23(VDD33(IO)) U11.27(VBUS_DET) U11.29(VDDA33) U11.36(VDDPLLREF/VDDA33) ; also sheet 1,2,3,5,6,7,8,9,10,11,12
DC_5V: C54.P$1 J21.1 R46.P$2 ; also sheet 1,2,3,5,7,8,9,10,11,12
EMMC_DISABLE_N: Q4.3(D) ; also sheet 2
EMMC_EN_N_1V8: Q5.1(G) R47.P$2 ; also sheet 2
GND: C39.P$2 C40.P$1 C41.P$1 C42.P$1 C43.P$1 C44.P$1 C45.P$1 C46.P$2 C47.P$1 C48.P$1 C49.P$1 C50.P$1 C51.P$1 C52.P$1 C53.P$1 C54.P$2 J19.3 J20.5 J20.P$1(T) J20.P$2(T) J20.P$3(T) J21.4 J21.P$1(T) J21.P$2(T) Q1.2(S) Q2.2(S) Q3.2(S) Q5.2(S) R49.P$2 R50.P$2 R53.P$2 R54.P$2 R55.P$2 U10.5(GND) U10.10(#OE) U11.11(TEST) U11.C(VSS(EXPOSED_PAD)) Y1.2 Y1.4 ; also sheet 1,2,3,5,6,7,8,9,10,11,12
HOST_USB_D_N [USB]: J20.2 U10.6(HSD1-)
HOST_USB_D_P [USB]: J20.3 U10.7(HSD1+)
HOST_USB_VBUS: J19.1 J20.1 Q1.1(G) R50.P$1
MAIN_USB_D_N [USB]: U10.8(HSD2-) U11.30(USBDM_UP)
MAIN_USB_D_P [USB]: U10.9(HSD2+) U11.31(USBDP_UP)
N$3: Q4.2(S) Q5.3(D) R114.P$1
N$5: J19.2 Q4.1(G) R49.P$1
N$37: D8.K R114.P$2
N$45: Q1.3(D) R45.P$2 U10.2(SEL)
N$212: C46.P$1 U11.33(XTALIN/CLKIN) Y1.3
N$214: C41.P$2 U11.32(XTALOUT) Y1.1
N$215: R53.P$1 U11.24(SCL/SMBCLK/CFG_SEL0)
N$216: C42.P$2 C43.P$2 U11.34(PLLFILT)
N$217: C44.P$2 C45.P$2 U11.14(CRFILT)
N$218: R55.P$1 U11.25(HS_IND/CFG_SEL1)
N$219: R54.P$1 U11.35(RBIAS)
N$220: R51.P$2 U11.13(#OCS1) U11.17(#OCS2) U11.19(#OCS3) U11.21(#OCS4)
N$221: R56.P$1 U11.22(SDA/SMBDATA/NON_REM1)
N$223: R52.P$2 U11.28(SUSP_IND/LOCAL_PWR/NON_REM0)
N$227: Q2.3(D) Q3.1(G) R46.P$1
USB1_DN1_D_N [USB]: J21.2 U11.1(USBDM_DN1)
USB1_DN1_D_P [USB]: J21.3 U11.2(USBDP_DN1)
USB1_DN2_D_N [USB]: U11.3(USBDM_DN2) ; also sheet 5
USB1_DN2_D_P [USB]: U11.4(USBDP_DN2) ; also sheet 5
USB1_DN3_D_N [USB]: U11.6(USBDM_DN3) ; also sheet 6
USB1_DN3_D_P [USB]: U11.7(USBDP_DN3) ; also sheet 6
USB1_DN4_D_N [USB]: U11.8(USBDM_DN4) ; also sheet 5
USB1_DN4_D_P [USB]: U11.9(USBDP_DN4) ; also sheet 5
USB_#RESET: C40.P$2 Q3.3(D) R48.P$1 U11.26(#RESET) ; also sheet 5,6
USB_RESET_OFF: Q2.1(G) ; also sheet 2
Unconnected: J20.4 U11.12(PRTPWR1) U11.16(PRTPWR2) U11.18(PRTPWR3) U11.20(PRTPWR4)

### Notes on the sheet
- Note the _N and _P suffixes
  are needed for Eagle to
  recognize the nets as diff'l.
- To second level hub
- NC: Int. Rpd
- To second level hub
- #SEL => HSD1;
  SEL => HSD2
- NC: Int. Rpd
- Micro-B for
  programming.
- To second level hub
- Power from the micro-USB jack
  steers the CM3's USB lines to
  the micro jack.  When absent,
  the rest of the board is connected.
- NC: Int. Rpd
- NC: Int. Rpd
- NON_REM[1:0] = b11 means
  Ports 1,2,3 are non-removable
- Spare port,
  general purpose.
- Select Defailt Config:
  * Self-powered
  * Strap options
  * Individual power/OCS
- Low (and CM3 reset)
  puts hubs into reset.
- Jumper Positions:
  1-2 = USB Boot Enabled
  2-3 = USB Boot Disabled
- Top-level USB hub
- R-Pi Basestation
  USB network
- 1
- CTT-20190123S

## Sheet 5 of 12
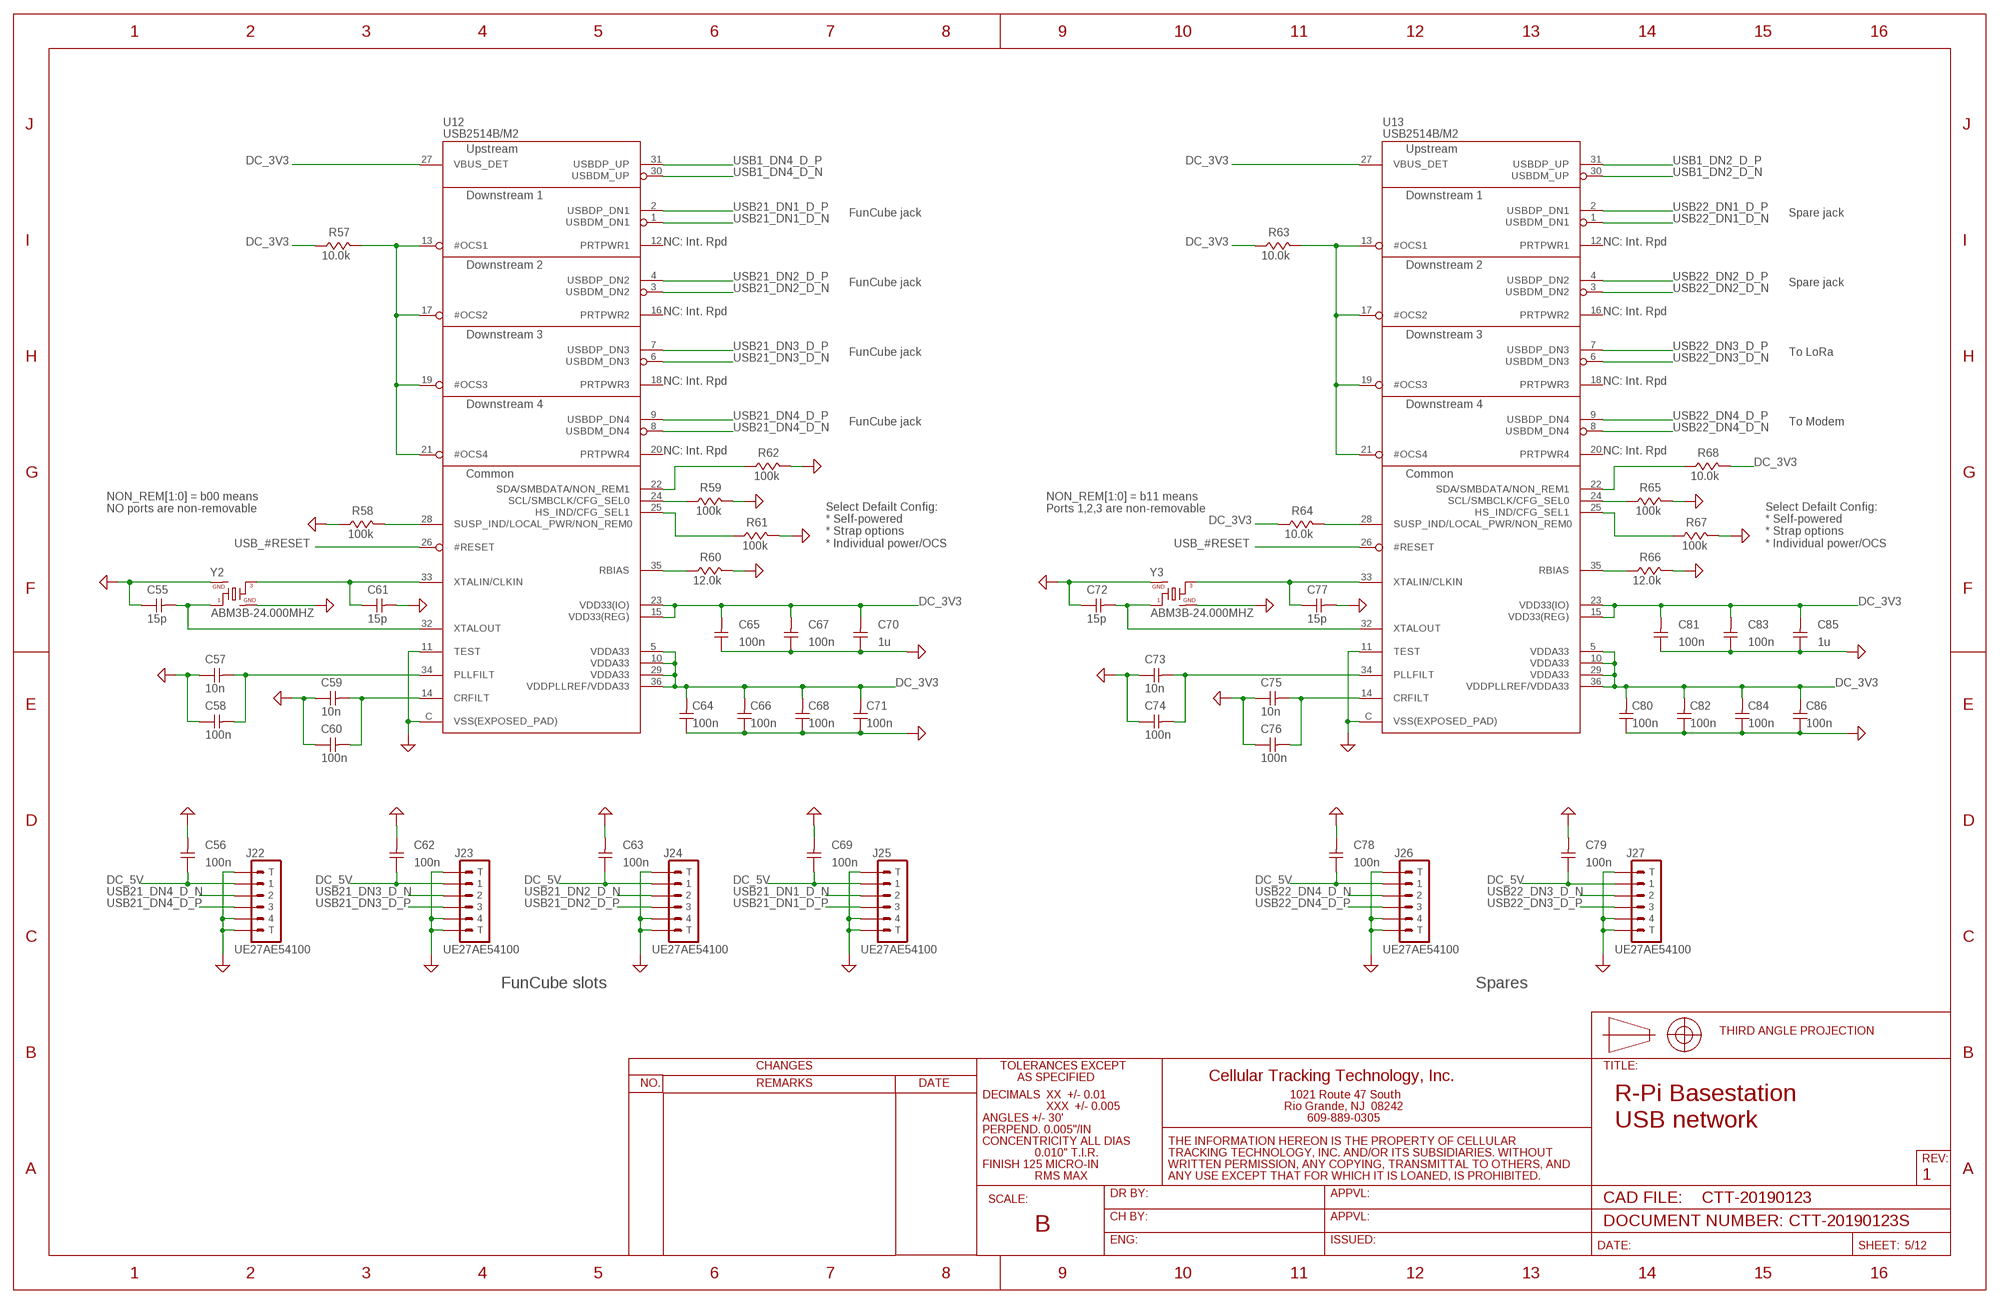
[diagram p4: schematic, sheet 5]

### Parts
C55  15p  C0402IPC_MED  [C0402_IPC7351_MED]
C56  100n  C0402IPC_MED  [C0402_IPC7351_MED]
C57  10n  C0402IPC_MED  [C0402_IPC7351_MED]
C58  100n  C0402IPC_MED  [C0402_IPC7351_MED]
C59  10n  C0402IPC_MED  [C0402_IPC7351_MED]
C60  100n  C0402IPC_MED  [C0402_IPC7351_MED]
C61  15p  C0402IPC_MED  [C0402_IPC7351_MED]
C62  100n  C0402IPC_MED  [C0402_IPC7351_MED]
C63  100n  C0402IPC_MED  [C0402_IPC7351_MED]
C64  100n  C0402IPC_MED  [C0402_IPC7351_MED]
C65  100n  C0402IPC_MED  [C0402_IPC7351_MED]
C66  100n  C0402IPC_MED  [C0402_IPC7351_MED]
C67  100n  C0402IPC_MED  [C0402_IPC7351_MED]
C68  100n  C0402IPC_MED  [C0402_IPC7351_MED]
C69  100n  C0402IPC_MED  [C0402_IPC7351_MED]
C70  1u  C0603_IPC7351_MED  [C0603_IPC7351_MED]
C71  100n  C0402IPC_MED  [C0402_IPC7351_MED]
C72  15p  C0402IPC_MED  [C0402_IPC7351_MED]
C73  10n  C0402IPC_MED  [C0402_IPC7351_MED]
C74  100n  C0402IPC_MED  [C0402_IPC7351_MED]
C75  10n  C0402IPC_MED  [C0402_IPC7351_MED]
C76  100n  C0402IPC_MED  [C0402_IPC7351_MED]
C77  15p  C0402IPC_MED  [C0402_IPC7351_MED]
C78  100n  C0402IPC_MED  [C0402_IPC7351_MED]
C79  100n  C0402IPC_MED  [C0402_IPC7351_MED]
C80  100n  C0402IPC_MED  [C0402_IPC7351_MED]
C81  100n  C0402IPC_MED  [C0402_IPC7351_MED]
C82  100n  C0402IPC_MED  [C0402_IPC7351_MED]
C83  100n  C0402IPC_MED  [C0402_IPC7351_MED]
C84  100n  C0402IPC_MED  [C0402_IPC7351_MED]
C85  1u  C0603_IPC7351_MED  [C0603_IPC7351_MED]
C86  100n  C0402IPC_MED  [C0402_IPC7351_MED]
J22  UE27AE54100  [UE27AE54100]
J23  UE27AE54100  [UE27AE54100]
J24  UE27AE54100  [UE27AE54100]
J25  UE27AE54100  [UE27AE54100]
J26  UE27AE54100  [UE27AE54100]
J27  UE27AE54100  [UE27AE54100]
R57  10.0k  R0402MED  [R0402_IPC7351_MED]
R58  100k  R0402MED  [R0402_IPC7351_MED]
R59  100k  R0402MED  [R0402_IPC7351_MED]
R60  12.0k  R0402MED  [R0402_IPC7351_MED]
R61  100k  R0402MED  [R0402_IPC7351_MED]
R62  100k  R0402MED  [R0402_IPC7351_MED]
R63  10.0k  R0402MED  [R0402_IPC7351_MED]
R64  10.0k  R0402MED  [R0402_IPC7351_MED]
R65  100k  R0402MED  [R0402_IPC7351_MED]
R66  12.0k  R0402MED  [R0402_IPC7351_MED]
R67  100k  R0402MED  [R0402_IPC7351_MED]
R68  10.0k  R0402MED  [R0402_IPC7351_MED]
U12  USB2514B/M2  [SQFN-36]
U13  USB2514B/M2  [SQFN-36]
Y2  ABM3B-24.000MHZ  ABM3B-8.000MHZB2T  [ABM3B]
Y3  ABM3B-24.000MHZ  ABM3B-8.000MHZB2T  [ABM3B]

### Nets
DC_3V3: C64.P$2 C65.P$2 C66.P$2 C67.P$2 C68.P$2 C70.P$2 C71.P$2 C80.P$2 C81.P$2 C82.P$2 C83.P$2 C84.P$2 C85.P$2 C86.P$2 R57.P$1 R63.P$1 R64.P$1 R68.P$2 U12.5(VDDA33) U12.10(VDDA33) U12.15(VDD33(REG)) U12.23(VDD33(IO)) U12.27(VBUS_DET) U12.29(VDDA33) U12.36(VDDPLLREF/VDDA33) U13.5(VDDA33) U13.10(VDDA33) U13.15(VDD33(REG)) U13.23(VDD33(IO)) U13.27(VBUS_DET) U13.29(VDDA33) U13.36(VDDPLLREF/VDDA33) ; also sheet 1,2,3,4,6,7,8,9,10,11,12
DC_5V: C56.P$1 C62.P$1 C63.P$1 C69.P$1 C78.P$1 C79.P$1 J22.1 J23.1 J24.1 J25.1 J26.1 J27.1 ; also sheet 1,2,3,4,7,8,9,10,11,12
GND: C55.P$1 C56.P$2 C57.P$1 C58.P$1 C59.P$1 C60.P$1 C61.P$2 C62.P$2 C63.P$2 C64.P$1 C65.P$1 C66.P$1 C67.P$1 C68.P$1 C69.P$2 C70.P$1 C71.P$1 C72.P$1 C73.P$1 C74.P$1 C75.P$1 C76.P$1 C77.P$2 C78.P$2 C79.P$2 C80.P$1 C81.P$1 C82.P$1 C83.P$1 C84.P$1 C85.P$1 C86.P$1 J22.4 J22.P$1(T) J22.P$2(T) J23.4 J23.P$1(T) J23.P$2(T) J24.4 J24.P$1(T) J24.P$2(T) J25.4 J25.P$1(T) J25.P$2(T) J26.4 J26.P$1(T) J26.P$2(T) J27.4 J27.P$1(T) J27.P$2(T) R58.P$1 R59.P$2 R60.P$2 R61.P$2 R62.P$2 R65.P$2 R66.P$2 R67.P$2 U12.11(TEST) U12.C(VSS(EXPOSED_PAD)) U13.11(TEST) U13.C(VSS(EXPOSED_PAD)) Y2.2 Y2.4 Y3.2 Y3.4 ; also sheet 1,2,3,4,6,7,8,9,10,11,12
N$20: C77.P$1 U13.33(XTALIN/CLKIN) Y3.3
N$22: C72.P$2 U13.32(XTALOUT) Y3.1
N$23: C61.P$1 U12.33(XTALIN/CLKIN) Y2.3
N$24: C55.P$2 U12.32(XTALOUT) Y2.1
N$25: C57.P$2 C58.P$2 U12.34(PLLFILT)
N$26: C73.P$2 C74.P$2 U13.34(PLLFILT)
N$27: C59.P$2 C60.P$2 U12.14(CRFILT)
N$28: R59.P$1 U12.24(SCL/SMBCLK/CFG_SEL0)
N$29: C75.P$2 C76.P$2 U13.14(CRFILT)
N$30: R65.P$1 U13.24(SCL/SMBCLK/CFG_SEL0)
N$31: R61.P$1 U12.25(HS_IND/CFG_SEL1)
N$35: R67.P$1 U13.25(HS_IND/CFG_SEL1)
N$225: R60.P$1 U12.35(RBIAS)
N$226: R57.P$2 U12.13(#OCS1) U12.17(#OCS2) U12.19(#OCS3) U12.21(#OCS4)
N$228: R62.P$1 U12.22(SDA/SMBDATA/NON_REM1)
N$229: R58.P$2 U12.28(SUSP_IND/LOCAL_PWR/NON_REM0)
N$230: R66.P$1 U13.35(RBIAS)
N$231: R63.P$2 U13.13(#OCS1) U13.17(#OCS2) U13.19(#OCS3) U13.21(#OCS4)
N$232: R68.P$1 U13.22(SDA/SMBDATA/NON_REM1)
N$233: R64.P$2 U13.28(SUSP_IND/LOCAL_PWR/NON_REM0)
USB1_DN2_D_N [USB]: U13.30(USBDM_UP) ; also sheet 4
USB1_DN2_D_P [USB]: U13.31(USBDP_UP) ; also sheet 4
USB1_DN4_D_N [USB]: U12.30(USBDM_UP) ; also sheet 4
USB1_DN4_D_P [USB]: U12.31(USBDP_UP) ; also sheet 4
USB21_DN1_D_N [USB]: J25.2 U12.1(USBDM_DN1)
USB21_DN1_D_P [USB]: J25.3 U12.2(USBDP_DN1)
USB21_DN2_D_N [USB]: J24.2 U12.3(USBDM_DN2)
USB21_DN2_D_P [USB]: J24.3 U12.4(USBDP_DN2)
USB21_DN3_D_N [USB]: J23.2 U12.6(USBDM_DN3)
USB21_DN3_D_P [USB]: J23.3 U12.7(USBDP_DN3)
USB21_DN4_D_N [USB]: J22.2 U12.8(USBDM_DN4)
USB21_DN4_D_P [USB]: J22.3 U12.9(USBDP_DN4)
USB22_DN1_D_N [USB]: U13.1(USBDM_DN1) ; also sheet 7
USB22_DN1_D_P [USB]: U13.2(USBDP_DN1) ; also sheet 7
USB22_DN2_D_N [USB]: U13.3(USBDM_DN2) ; also sheet 8
USB22_DN2_D_P [USB]: U13.4(USBDP_DN2) ; also sheet 8
USB22_DN3_D_N [USB]: J27.2 U13.6(USBDM_DN3)
USB22_DN3_D_P [USB]: J27.3 U13.7(USBDP_DN3)
USB22_DN4_D_N [USB]: J26.2 U13.8(USBDM_DN4)
USB22_DN4_D_P [USB]: J26.3 U13.9(USBDP_DN4)
USB_#RESET: U12.26(#RESET) U13.26(#RESET) ; also sheet 4,6
Unconnected: U12.12(PRTPWR1) U12.16(PRTPWR2) U12.18(PRTPWR3) U12.20(PRTPWR4) U13.12(PRTPWR1) U13.16(PRTPWR2) U13.18(PRTPWR3) U13.20(PRTPWR4)

### Notes on the sheet
- FunCube jack | Spare jack
- NC: Int. Rpd | NC: Int. Rpd
- FunCube jack | Spare jack
- NC: Int. Rpd | NC: Int. Rpd
- FunCube jack | To LoRa
- NC: Int. Rpd | NC: Int. Rpd
- FunCube jack | To Modem
- NC: Int. Rpd | NC: Int. Rpd
- NON_REM[1:0] = b00 means
  NO ports are non-removable
- NON_REM[1:0] = b11 means
  Ports 1,2,3 are non-removable
- Select Defailt Config:
  * Self-powered
  * Strap options
  * Individual power/OCS
- Select Defailt Config:
  * Self-powered
  * Strap options
  * Individual power/OCS
- FunCube slots | Spares
- R-Pi Basestation
  USB network
- 1
- CTT-20190123S

## Sheet 6 of 12
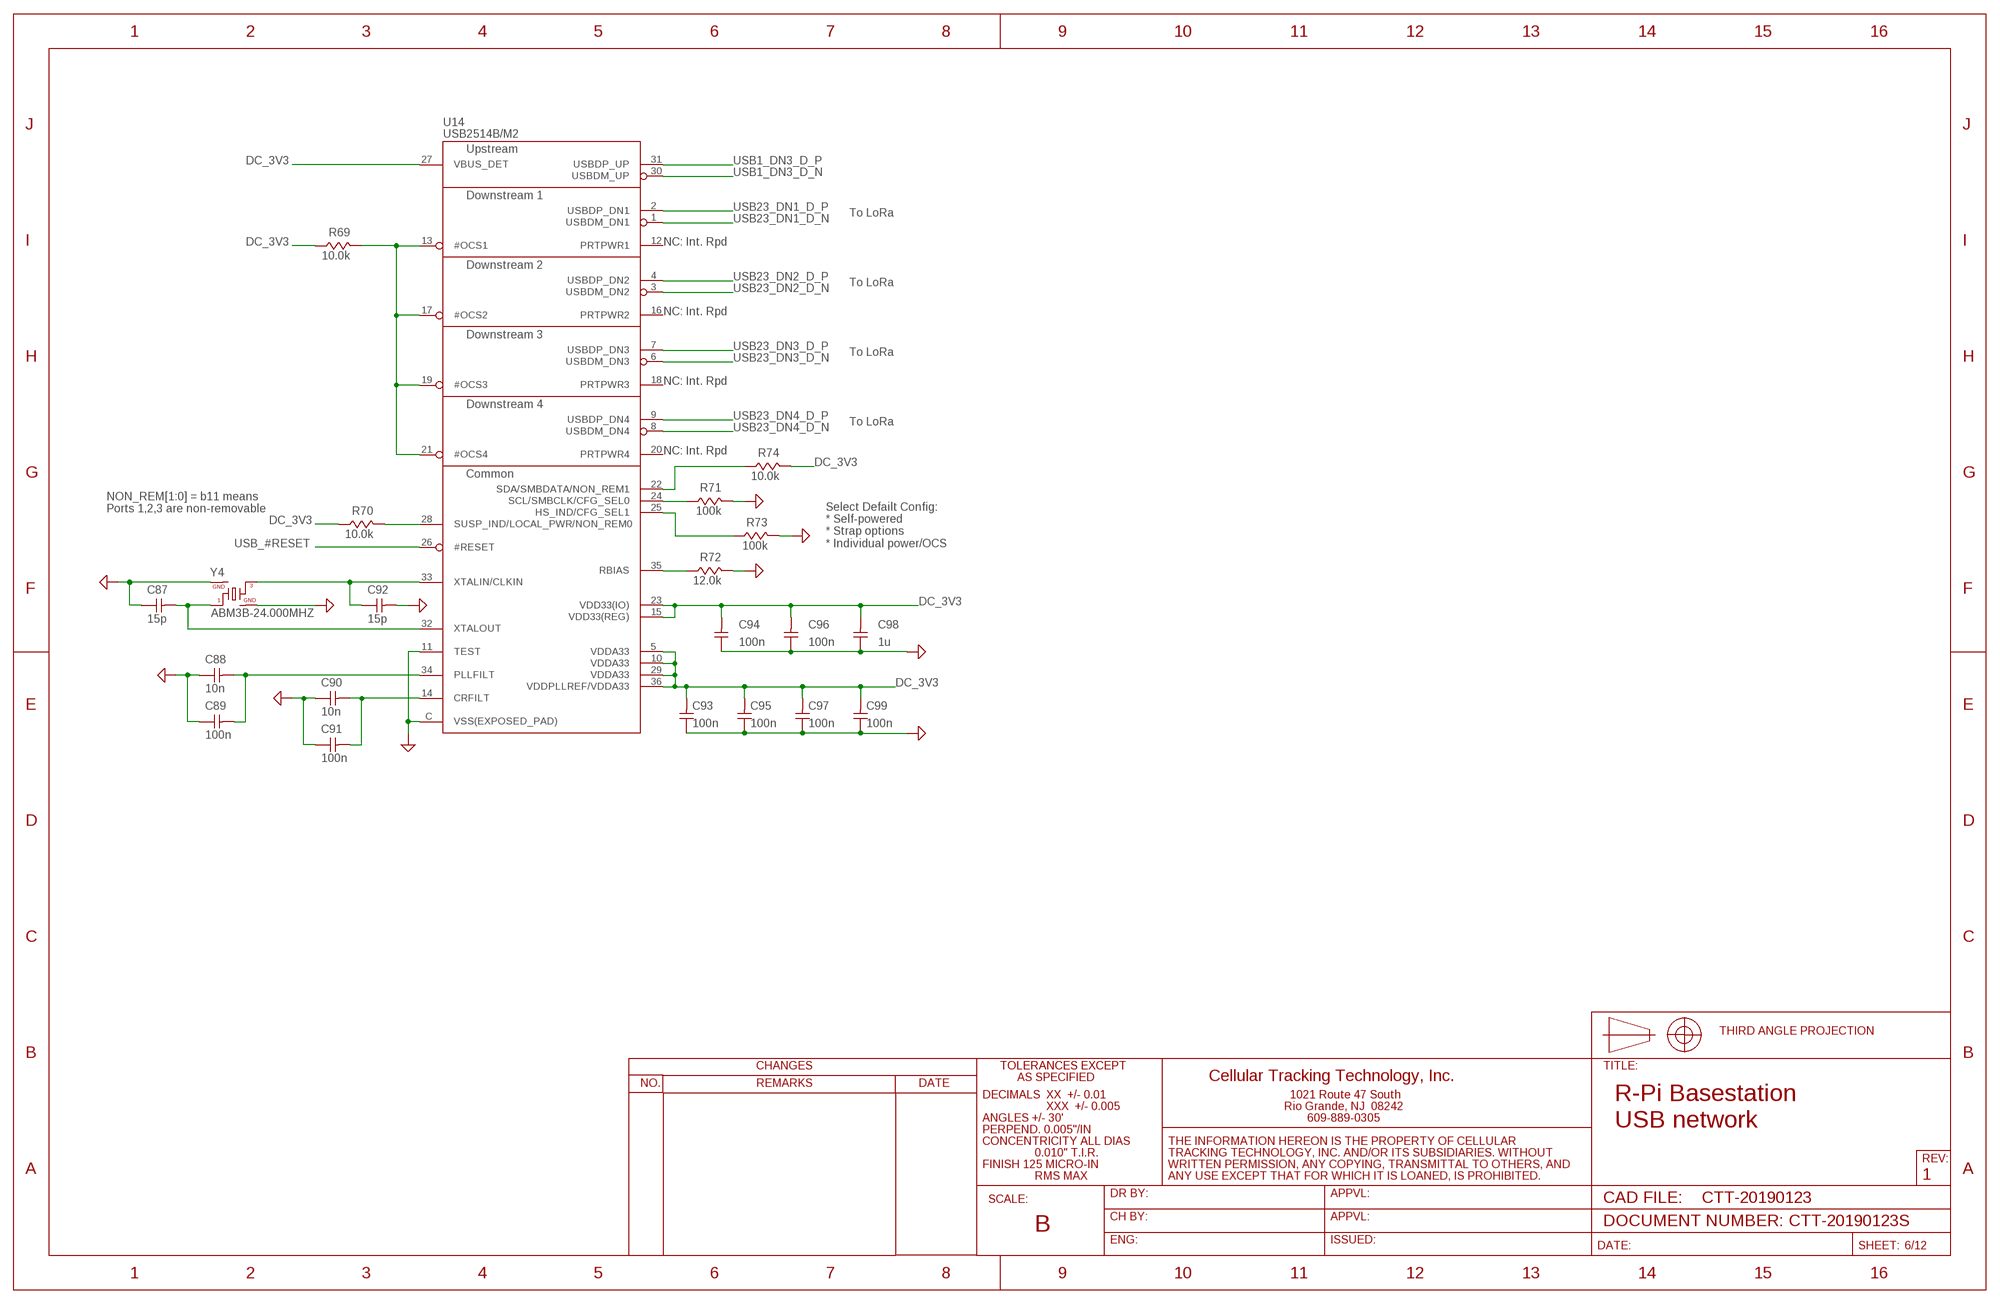
[diagram p5: schematic, sheet 6]

### Parts
C87  15p  C0402IPC_MED  [C0402_IPC7351_MED]
C88  10n  C0402IPC_MED  [C0402_IPC7351_MED]
C89  100n  C0402IPC_MED  [C0402_IPC7351_MED]
C90  10n  C0402IPC_MED  [C0402_IPC7351_MED]
C91  100n  C0402IPC_MED  [C0402_IPC7351_MED]
C92  15p  C0402IPC_MED  [C0402_IPC7351_MED]
C93  100n  C0402IPC_MED  [C0402_IPC7351_MED]
C94  100n  C0402IPC_MED  [C0402_IPC7351_MED]
C95  100n  C0402IPC_MED  [C0402_IPC7351_MED]
C96  100n  C0402IPC_MED  [C0402_IPC7351_MED]
C97  100n  C0402IPC_MED  [C0402_IPC7351_MED]
C98  1u  C0603_IPC7351_MED  [C0603_IPC7351_MED]
C99  100n  C0402IPC_MED  [C0402_IPC7351_MED]
R69  10.0k  R0402MED  [R0402_IPC7351_MED]
R70  10.0k  R0402MED  [R0402_IPC7351_MED]
R71  100k  R0402MED  [R0402_IPC7351_MED]
R72  12.0k  R0402MED  [R0402_IPC7351_MED]
R73  100k  R0402MED  [R0402_IPC7351_MED]
R74  10.0k  R0402MED  [R0402_IPC7351_MED]
U14  USB2514B/M2  [SQFN-36]
Y4  ABM3B-24.000MHZ  ABM3B-8.000MHZB2T  [ABM3B]

### Nets
DC_3V3: C93.P$2 C94.P$2 C95.P$2 C96.P$2 C97.P$2 C98.P$2 C99.P$2 R69.P$1 R70.P$1 R74.P$2 U14.5(VDDA33) U14.10(VDDA33) U14.15(VDD33(REG)) U14.23(VDD33(IO)) U14.27(VBUS_DET) U14.29(VDDA33) U14.36(VDDPLLREF/VDDA33) ; also sheet 1,2,3,4,5,7,8,9,10,11,12
GND: C87.P$1 C88.P$1 C89.P$1 C90.P$1 C91.P$1 C92.P$2 C93.P$1 C94.P$1 C95.P$1 C96.P$1 C97.P$1 C98.P$1 C99.P$1 R71.P$2 R72.P$2 R73.P$2 U14.11(TEST) U14.C(VSS(EXPOSED_PAD)) Y4.2 Y4.4 ; also sheet 1,2,3,4,5,7,8,9,10,11,12
N$17: C92.P$1 U14.33(XTALIN/CLKIN) Y4.3
N$19: C87.P$2 U14.32(XTALOUT) Y4.1
N$32: C88.P$2 C89.P$2 U14.34(PLLFILT)
N$33: C90.P$2 C91.P$2 U14.14(CRFILT)
N$34: R71.P$1 U14.24(SCL/SMBCLK/CFG_SEL0)
N$39: R73.P$1 U14.25(HS_IND/CFG_SEL1)
N$234: R72.P$1 U14.35(RBIAS)
N$235: R69.P$2 U14.13(#OCS1) U14.17(#OCS2) U14.19(#OCS3) U14.21(#OCS4)
N$236: R74.P$1 U14.22(SDA/SMBDATA/NON_REM1)
N$237: R70.P$2 U14.28(SUSP_IND/LOCAL_PWR/NON_REM0)
USB1_DN3_D_N [USB]: U14.30(USBDM_UP) ; also sheet 4
USB1_DN3_D_P [USB]: U14.31(USBDP_UP) ; also sheet 4
USB23_DN1_D_N [USB]: U14.1(USBDM_DN1) ; also sheet 9
USB23_DN1_D_P [USB]: U14.2(USBDP_DN1) ; also sheet 9
USB23_DN2_D_N [USB]: U14.3(USBDM_DN2) ; also sheet 10
USB23_DN2_D_P [USB]: U14.4(USBDP_DN2) ; also sheet 10
USB23_DN3_D_N [USB]: U14.6(USBDM_DN3) ; also sheet 11
USB23_DN3_D_P [USB]: U14.7(USBDP_DN3) ; also sheet 11
USB23_DN4_D_N [USB]: U14.8(USBDM_DN4) ; also sheet 12
USB23_DN4_D_P [USB]: U14.9(USBDP_DN4) ; also sheet 12
USB_#RESET: U14.26(#RESET) ; also sheet 4,5
Unconnected: U14.12(PRTPWR1) U14.16(PRTPWR2) U14.18(PRTPWR3) U14.20(PRTPWR4)

### Notes on the sheet
- To LoRa
- NC: Int. Rpd
- To LoRa
- NC: Int. Rpd
- To LoRa
- NC: Int. Rpd
- To LoRa
- NC: Int. Rpd
- NON_REM[1:0] = b11 means
  Ports 1,2,3 are non-removable
- Select Defailt Config:
  * Self-powered
  * Strap options
  * Individual power/OCS
- R-Pi Basestation
  USB network
- 1
- CTT-20190123S

## Sheet 7 of 12
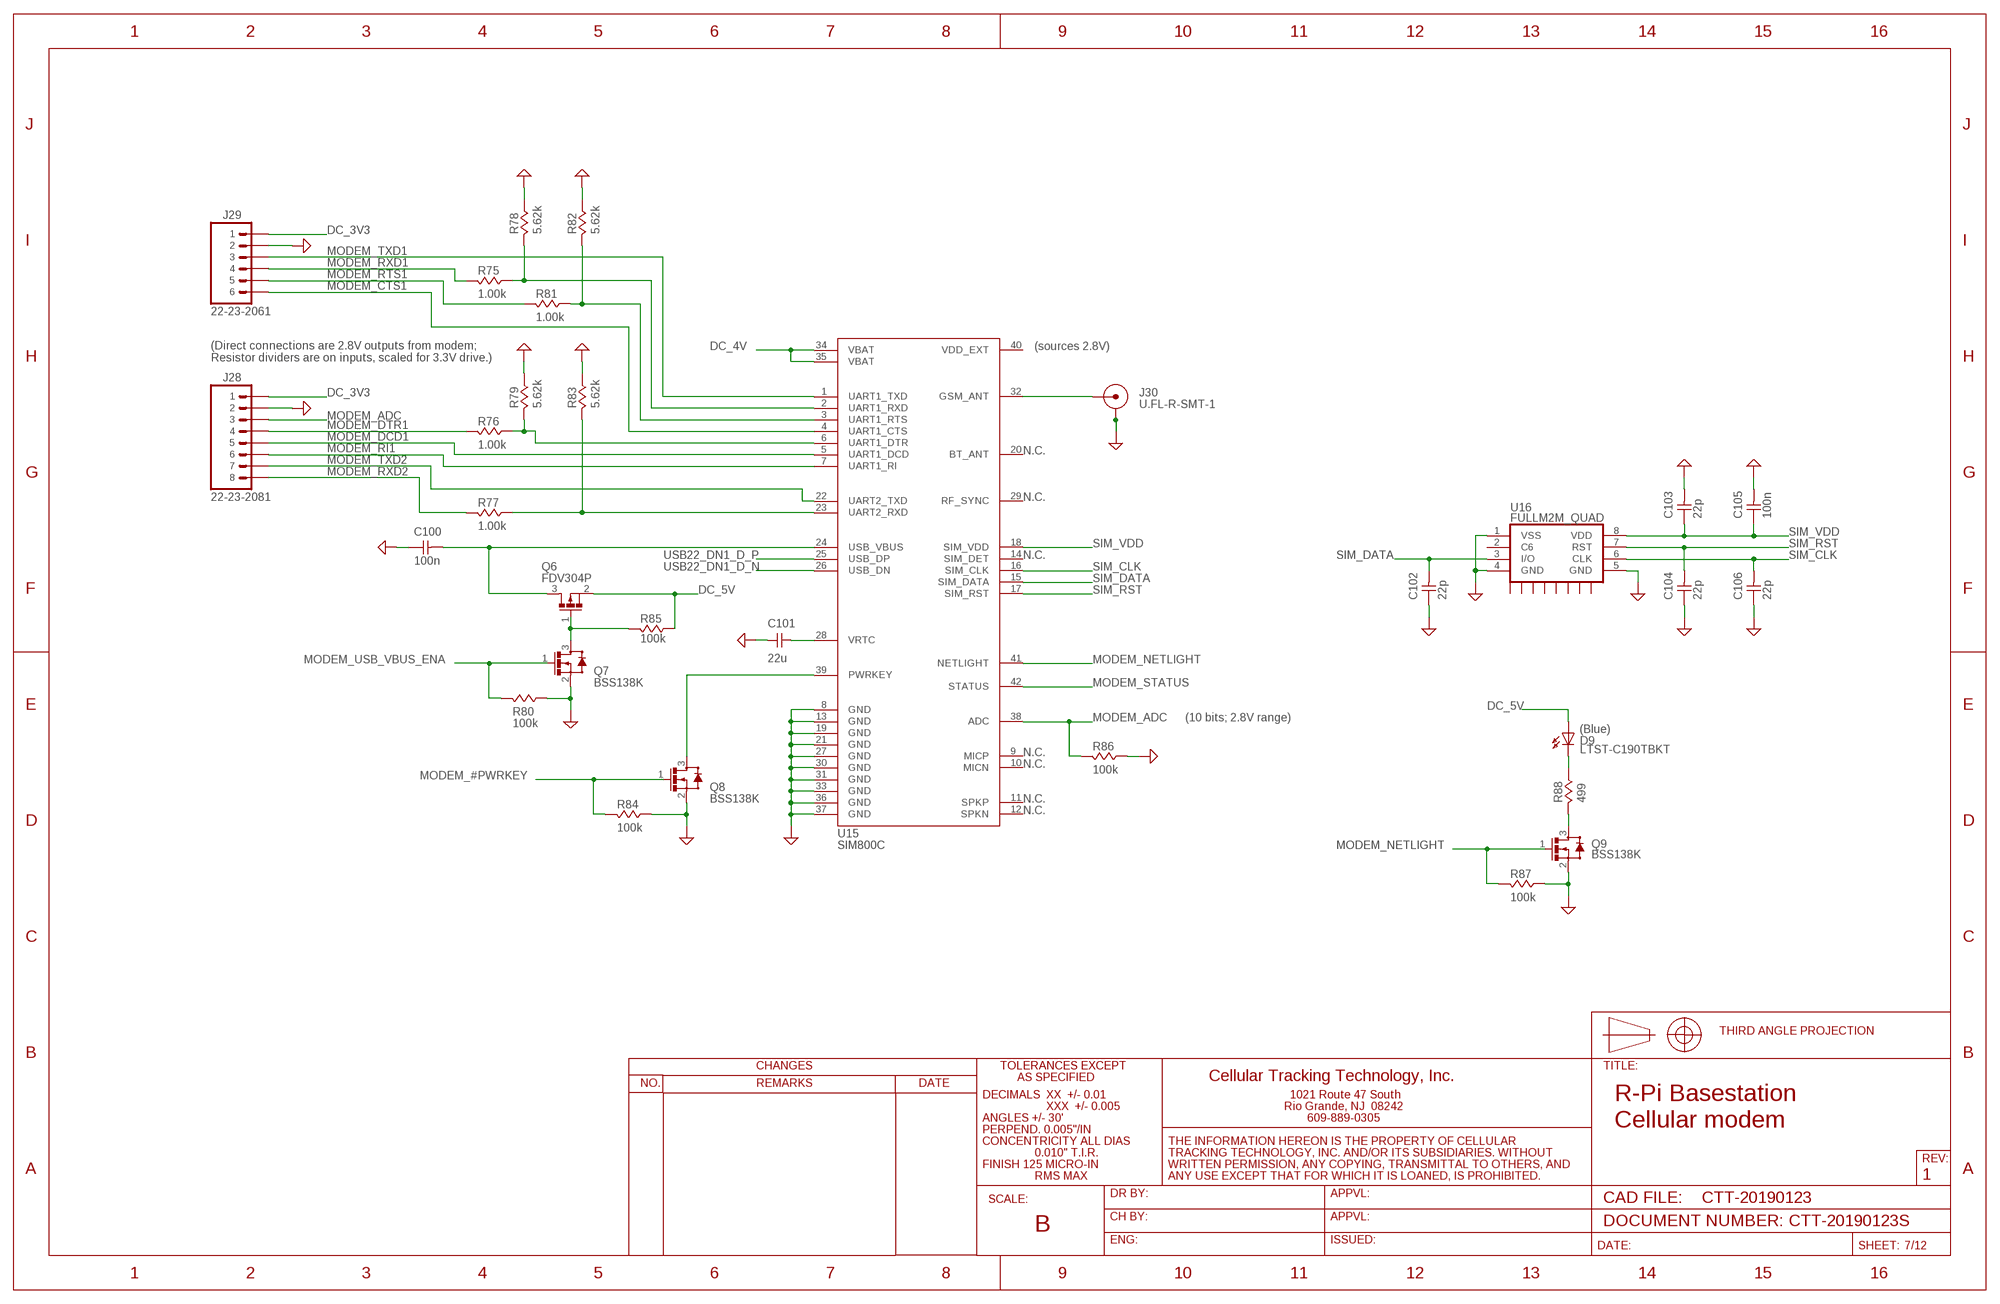
[diagram p6: schematic, sheet 7]

### Parts
C100  100n  C0402IPC_MED  [C0402_IPC7351_MED]
C101  22u  C0805  [C0805]
C102  22p  C0402IPC_MED  [C0402_IPC7351_MED]
C103  22p  C0402IPC_MED  [C0402_IPC7351_MED]
C104  22p  C0402IPC_MED  [C0402_IPC7351_MED]
C105  100n  C0402IPC_MED  [C0402_IPC7351_MED]
C106  22p  C0402IPC_MED  [C0402_IPC7351_MED]
D9  LTST-C190TBKT  LTST-C190GKT  [LED0603]
J28  22-23-2081  640456-8  [MTA100-8]
J29  22-23-2061  640456-6  [MTA100-6]
J30  U.FL-R-SMT-1  [U.FL-R-SMT-1]
Q6  FDV304P  [SOT-23]
Q7  BSS138K  BSS138  [SOT-23]
Q8  BSS138K  BSS138  [SOT-23]
Q9  BSS138K  BSS138  [SOT-23]
R75  1.00k  R0402MED  [R0402_IPC7351_MED]
R76  1.00k  R0402MED  [R0402_IPC7351_MED]
R77  1.00k  R0402MED  [R0402_IPC7351_MED]
R78  5.62k  R0402MED  [R0402_IPC7351_MED]
R79  5.62k  R0402MED  [R0402_IPC7351_MED]
R80  100k  R0402MED  [R0402_IPC7351_MED]
R81  1.00k  R0402MED  [R0402_IPC7351_MED]
R82  5.62k  R0402MED  [R0402_IPC7351_MED]
R83  5.62k  R0402MED  [R0402_IPC7351_MED]
R84  100k  R0402MED  [R0402_IPC7351_MED]
R85  100k  R0402MED  [R0402_IPC7351_MED]
R86  100k  R0402MED  [R0402_IPC7351_MED]
R87  100k  R0402MED  [R0402_IPC7351_MED]
R88  499  R0402MED  [R0402_IPC7351_MED]
U15  SIM800C  [SIM800C]
U16  FULLM2M_QUAD  [MFF2]

### Nets
DC_3V3: J28.1 J29.1 ; also sheet 1,2,3,4,5,6,8,9,10,11,12
DC_4V: U15.34(VBAT) U15.35(VBAT) ; also sheet 1
DC_5V: D9.A Q6.2(S) R85.P$1 ; also sheet 1,2,3,4,5,8,9,10,11,12
GND: C100.P$1 C101.1 C102.P$1 C103.P$2 C104.P$1 C105.P$2 C106.P$1 J28.2 J29.2 J30.GND J30.GND@1(GND) Q7.2(S) Q8.2(S) Q9.2(S) R78.P$1 R79.P$1 R80.P$1 R82.P$1 R83.P$1 R84.P$1 R86.P$1 R87.P$1 U15.8(GND) U15.13(GND) U15.19(GND) U15.21(GND) U15.27(GND) U15.30(GND) U15.31(GND) U15.33(GND) U15.36(GND) U15.37(GND) U16.1(VSS) U16.4(GND) U16.5(GND) ; also sheet 1,2,3,4,5,6,8,9,10,11,12
MODEM_#PWRKEY: Q8.1(G) R84.P$2 ; also sheet 2,3
MODEM_ADC: J28.3 R86.P$2 U15.38(ADC)
MODEM_CTS1: J29.6 U15.4(UART1_CTS) ; also sheet 2
MODEM_DCD1: J28.5 U15.5(UART1_DCD)
MODEM_DTR1: J28.4 R76.P$2
MODEM_NETLIGHT: Q9.1(G) R87.P$2 U15.41(NETLIGHT)
MODEM_RI1: J28.6 U15.7(UART1_RI)
MODEM_RTS1: J29.5 R81.P$2 ; also sheet 2
MODEM_RXD1: J29.4 R75.P$2 ; also sheet 2
MODEM_RXD2: J28.8 R77.P$2
MODEM_STATUS: U15.42(STATUS) ; also sheet 2
MODEM_TXD1: J29.3 U15.1(UART1_TXD) ; also sheet 2
MODEM_TXD2: J28.7 U15.22(UART2_TXD)
MODEM_USB_VBUS_ENA: Q7.1(G) R80.P$2 ; also sheet 2
N$36: Q8.3(D) U15.39(PWRKEY)
N$41: C101.2 U15.28(VRTC)
N$42: C100.P$2 Q6.3(D) U15.24(USB_VBUS)
N$43: R77.P$1 R83.P$2 U15.23(UART2_RXD)
N$47: Q6.1(G) Q7.3(D) R85.P$2
N$48: J30.SIG U15.32(GSM_ANT)
N$49: R76.P$1 R79.P$2 U15.6(UART1_DTR)
N$50: D9.K R88.P$1
N$51: Q9.3(D) R88.P$2
N$53: R81.P$1 R82.P$2 U15.3(UART1_RTS)
N$54: R75.P$1 R78.P$2 U15.2(UART1_RXD)
SIM_CLK: C106.P$2 U15.16(SIM_CLK) U16.6(CLK)
SIM_DATA: C102.P$2 U15.15(SIM_DATA) U16.3(I/O)
SIM_RST: C104.P$2 U15.17(SIM_RST) U16.7(RST)
SIM_VDD: C103.P$1 C105.P$1 U15.18(SIM_VDD) U16.8(VDD)
USB22_DN1_D_N [USB]: U15.26(USB_DN) ; also sheet 5
USB22_DN1_D_P [USB]: U15.25(USB_DP) ; also sheet 5
Unconnected: U15.9(MICP) U15.10(MICN) U15.11(SPKP) U15.12(SPKN) U15.14(SIM_DET) U15.20(BT_ANT) U15.29(RF_SYNC) U15.40(VDD_EXT) U16.2(C6) U16.P$1(GND) U16.P$2(GND) U16.P$3(GND) U16.P$4(GND) U16.P$5(GND) U16.P$6(GND) U16.P$7(GND) U16.P$8(GND)

### Notes on the sheet
- (sources 2.8V)
- (Direct connections are 2.8V outputs from modem;
  Resistor dividers are on inputs, scaled for 3.3V drive.)
- N.C.
- N.C.
- N.C.
- (10 bits; 2.8V range)
- (Blue)
- N.C.
- N.C.
- N.C.
- N.C.
- R-Pi Basestation
  Cellular modem
- 1
- CTT-20190123S

## Sheet 8 of 12
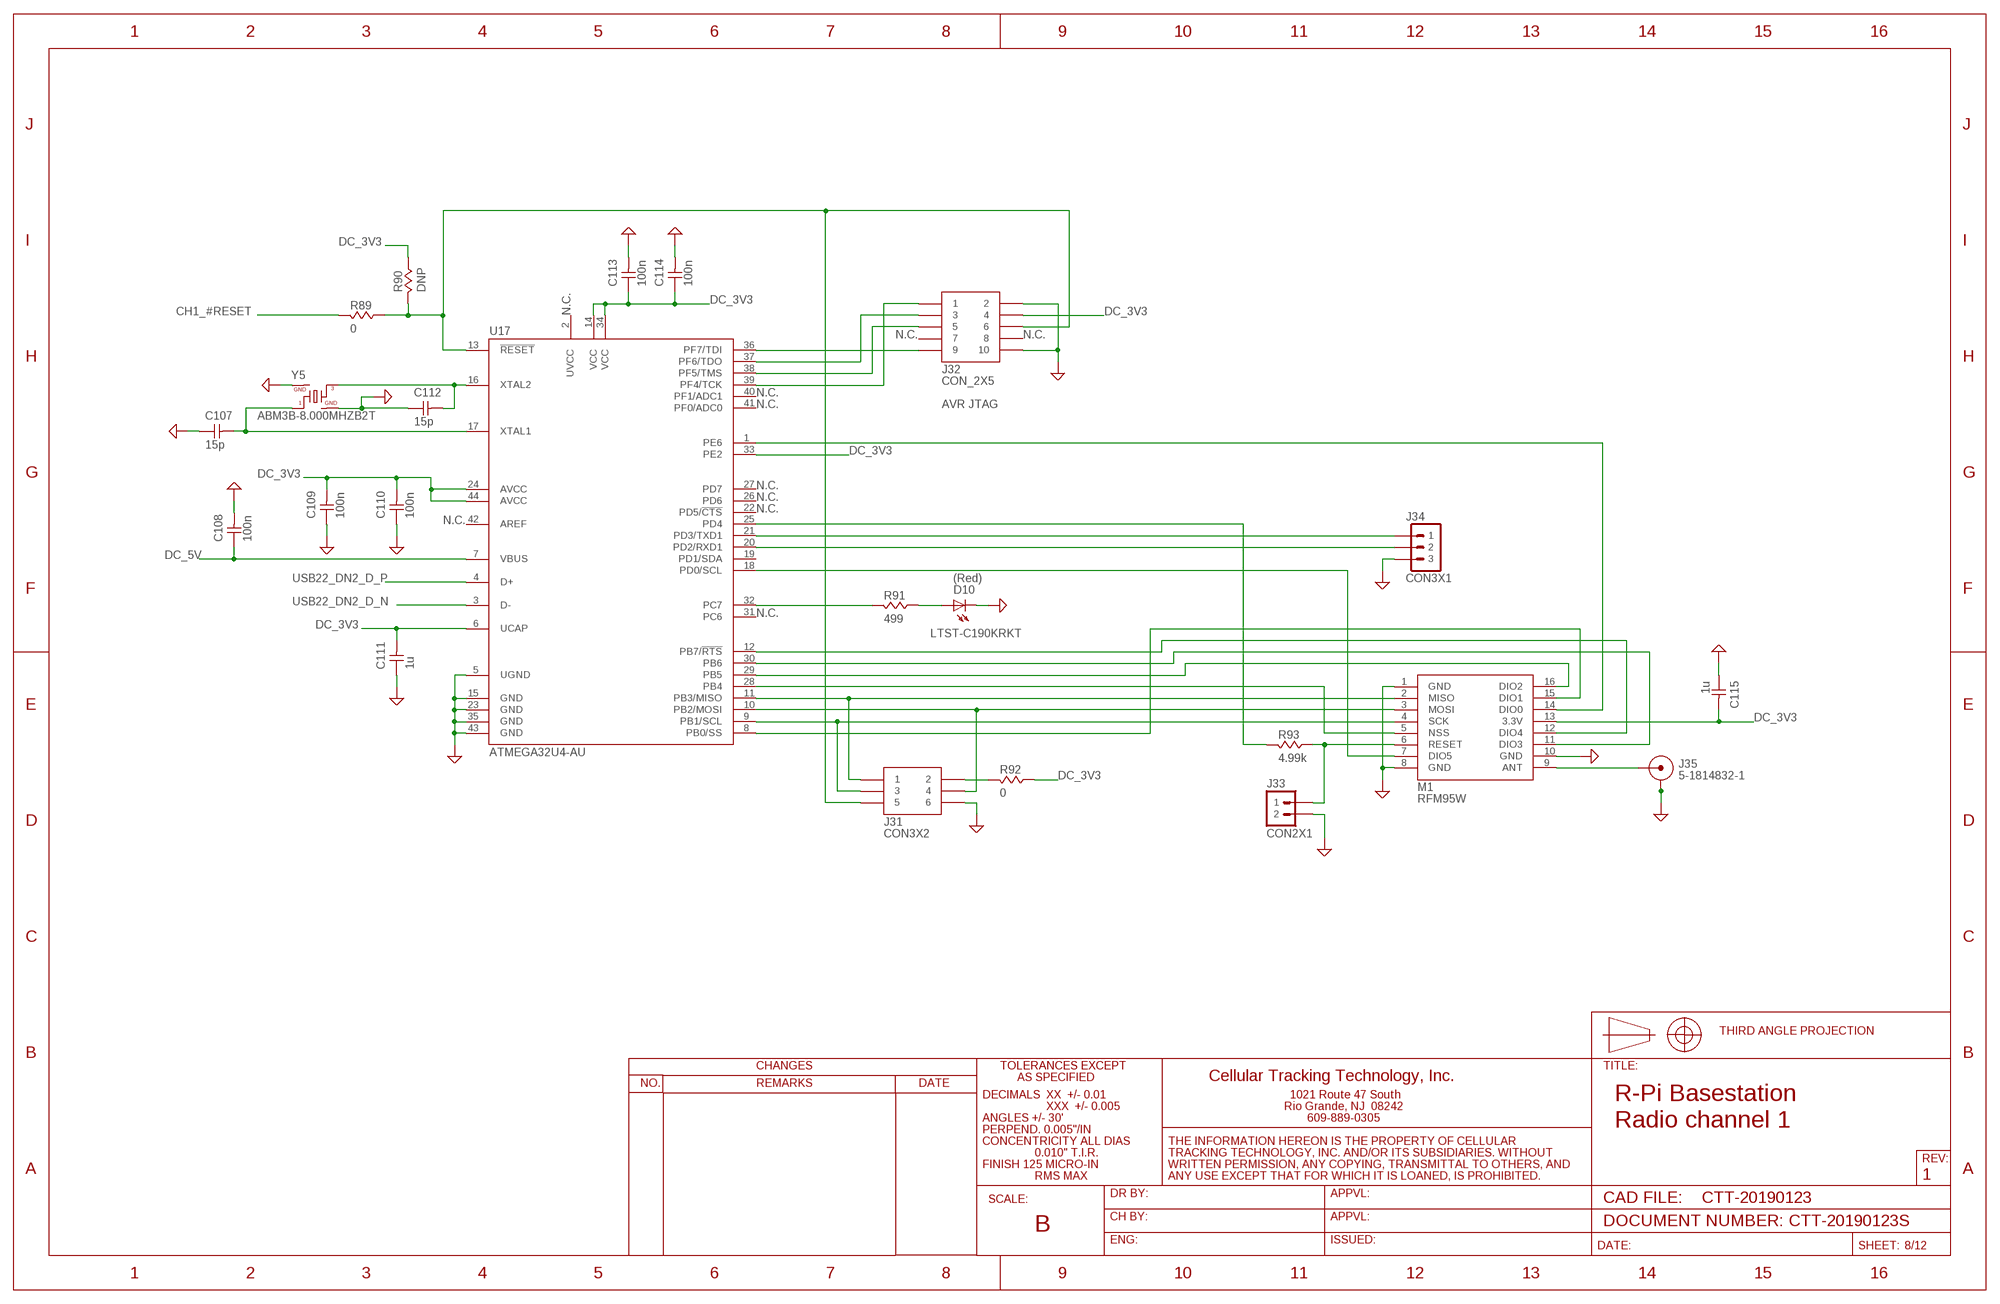
[diagram p7: schematic, sheet 8]

### Parts
C107  15p  C0402IPC_MED  [C0402_IPC7351_MED]
C108  100n  C0402IPC_MED  [C0402_IPC7351_MED]
C109  100n  C0402IPC_MED  [C0402_IPC7351_MED]
C110  100n  C0402IPC_MED  [C0402_IPC7351_MED]
C111  1u  C0603_IPC7351_MED  [C0603_IPC7351_MED]
C112  15p  C0402IPC_MED  [C0402_IPC7351_MED]
C113  100n  C0402IPC_MED  [C0402_IPC7351_MED]
C114  100n  C0402IPC_MED  [C0402_IPC7351_MED]
C115  1u  C0603_IPC7351_MED  [C0603_IPC7351_MED]
D10  LTST-C190KRKT  LTST-C190GKT  [LED0603]
J31  CON3X2  [CON3X2]
J32  CON_2X5  [CON_5X2]
J33  CON2X1  [CON2X1]
J34  CON3X1  [CON3X1]
J35  5-1814832-1  CON_COAXSMA_TH_VERT  [CON_SMA_TH_VERT]
M1  RFM95W  [RFM95W]
R89  0  R0402MED  [R0402_IPC7351_MED]
R90  DNP  R0402MED  [R0402_IPC7351_MED]
R91  499  R0402MED  [R0402_IPC7351_MED]
R92  0  R0402MED  [R0402_IPC7351_MED]
R93  4.99k  R0402MED  [R0402_IPC7351_MED]
U17  ATMEGA32U4-AU  [TQFP44]
Y5  ABM3B-8.000MHZB2T  [ABM3B]

### Nets
CH1_#RESET: R89.P$2 ; also sheet 2
DC_3V3: C109.P$2 C110.P$2 C111.P$2 C113.P$1 C114.P$1 C115.P$2 J32.4 M1.13(3.3V) R90.P$1 R92.P$1 U17.6(UCAP) U17.14(VCC) U17.24(AVCC) U17.33(PE2) U17.34(VCC) U17.44(AVCC) ; also sheet 1,2,3,4,5,6,7,9,10,11,12
DC_5V: C108.P$1 U17.7(VBUS) ; also sheet 1,2,3,4,5,7,9,10,11,12
GND: C107.P$1 C108.P$2 C109.P$1 C110.P$1 C111.P$1 C112.P$1 C113.P$2 C114.P$2 C115.P$1 D10.K J31.6 J32.2 J32.10 J33.2 J34.3 J35.P$1(GND) J35.P$2(GND) J35.P$3(GND) J35.P$4(GND) M1.1(GND) M1.8(GND) M1.10(GND) U17.5(UGND) U17.15(GND) U17.23(GND) U17.35(GND) U17.43(GND) Y5.2 Y5.4 ; also sheet 1,2,3,4,5,6,7,9,10,11,12
N$44: C112.P$2 U17.16(XTAL2) Y5.3
N$52: J32.1 U17.39(PF4/TCK)
N$55: C107.P$2 U17.17(XTAL1) Y5.1
N$56: J31.5 J32.6 R89.P$1 R90.P$2 U17.13(!RESET)
N$57: J32.5 U17.38(PF5/TMS)
N$58: J32.3 U17.37(PF6/TDO)
N$59: J32.9 U17.36(PF7/TDI)
N$60: J31.1 M1.2(MISO) U17.11(PB3/MISO)
N$61: J35.C(SIG) M1.9(ANT)
N$62: J31.4 M1.3(MOSI) U17.10(PB2/MOSI)
N$63: J31.3 M1.4(SCK) U17.9(PB1/SCL)
N$64: J33.1 M1.6(RESET) R93.P$1
N$65: R93.P$2 U17.25(PD4)
N$66: J34.1 U17.21(PD3/TXD1)
N$67: J34.2 U17.20(PD2/RXD1)
N$68: J31.2 R92.P$2
N$69: M1.5(NSS) U17.28(PB4)
N$70: M1.16(DIO2) U17.29(PB5)
N$71: M1.11(DIO3) U17.30(PB6)
N$72: M1.12(DIO4) U17.12(PB7/!RTS)
N$73: M1.7(DIO5) U17.18(PD0/SCL)
N$74: M1.14(DIO0) U17.1(PE6)
N$75: M1.15(DIO1) U17.8(PB0/SS)
N$76: R91.P$2 U17.32(PC7)
N$77: D10.A R91.P$1
USB22_DN2_D_N [USB]: U17.3(D-) ; also sheet 5
USB22_DN2_D_P [USB]: U17.4(D+) ; also sheet 5
Unconnected: J32.7 J32.8 U17.2(UVCC) U17.19(PD1/SDA) U17.22(PD5/!CTS) U17.26(PD6) U17.27(PD7) U17.31(PC6) U17.40(PF1/ADC1) U17.41(PF0/ADC0) U17.42(AREF)

### Notes on the sheet
- N.C.
- N.C. | N.C.
- N.C.
- N.C. | AVR JTAG
- N.C.
- N.C.
- N.C.
- N.C.
- (Red)
- N.C.
- R-Pi Basestation
  Radio channel 1
- 1
- CTT-20190123S

## Sheet 9 of 12
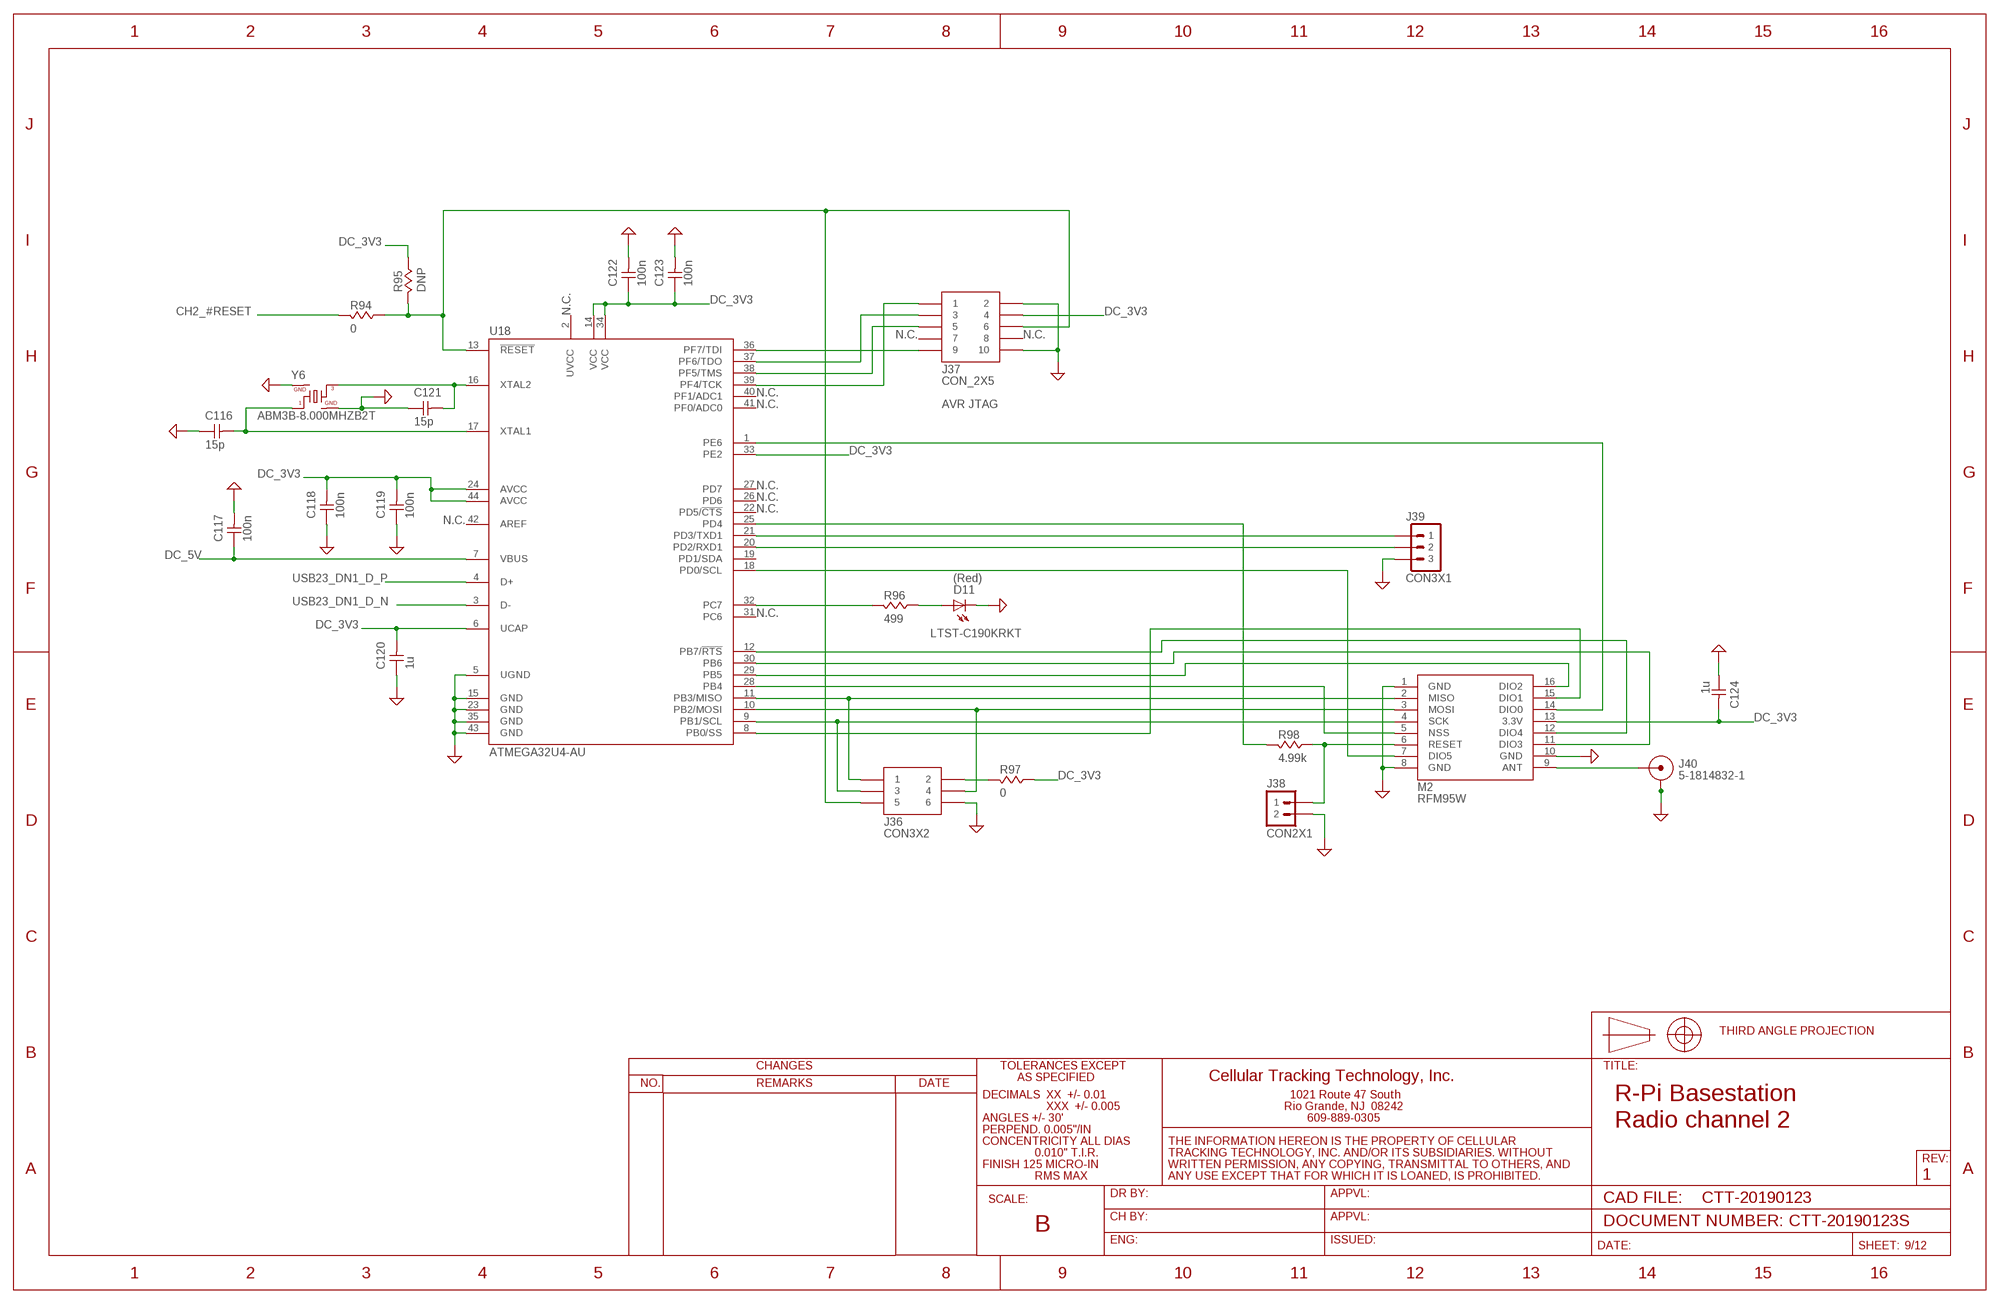
[diagram p8: schematic, sheet 9]

### Parts
C116  15p  C0402IPC_MED  [C0402_IPC7351_MED]
C117  100n  C0402IPC_MED  [C0402_IPC7351_MED]
C118  100n  C0402IPC_MED  [C0402_IPC7351_MED]
C119  100n  C0402IPC_MED  [C0402_IPC7351_MED]
C120  1u  C0603_IPC7351_MED  [C0603_IPC7351_MED]
C121  15p  C0402IPC_MED  [C0402_IPC7351_MED]
C122  100n  C0402IPC_MED  [C0402_IPC7351_MED]
C123  100n  C0402IPC_MED  [C0402_IPC7351_MED]
C124  1u  C0603_IPC7351_MED  [C0603_IPC7351_MED]
D11  LTST-C190KRKT  LTST-C190GKT  [LED0603]
J36  CON3X2  [CON3X2]
J37  CON_2X5  [CON_5X2]
J38  CON2X1  [CON2X1]
J39  CON3X1  [CON3X1]
J40  5-1814832-1  CON_COAXSMA_TH_VERT  [CON_SMA_TH_VERT]
M2  RFM95W  [RFM95W]
R94  0  R0402MED  [R0402_IPC7351_MED]
R95  DNP  R0402MED  [R0402_IPC7351_MED]
R96  499  R0402MED  [R0402_IPC7351_MED]
R97  0  R0402MED  [R0402_IPC7351_MED]
R98  4.99k  R0402MED  [R0402_IPC7351_MED]
U18  ATMEGA32U4-AU  [TQFP44]
Y6  ABM3B-8.000MHZB2T  [ABM3B]

### Nets
CH2_#RESET: R94.P$2 ; also sheet 2
DC_3V3: C118.P$2 C119.P$2 C120.P$2 C122.P$1 C123.P$1 C124.P$2 J37.4 M2.13(3.3V) R95.P$1 R97.P$1 U18.6(UCAP) U18.14(VCC) U18.24(AVCC) U18.33(PE2) U18.34(VCC) U18.44(AVCC) ; also sheet 1,2,3,4,5,6,7,8,10,11,12
DC_5V: C117.P$1 U18.7(VBUS) ; also sheet 1,2,3,4,5,7,8,10,11,12
GND: C116.P$1 C117.P$2 C118.P$1 C119.P$1 C120.P$1 C121.P$1 C122.P$2 C123.P$2 C124.P$1 D11.K J36.6 J37.2 J37.10 J38.2 J39.3 J40.P$1(GND) J40.P$2(GND) J40.P$3(GND) J40.P$4(GND) M2.1(GND) M2.8(GND) M2.10(GND) U18.5(UGND) U18.15(GND) U18.23(GND) U18.35(GND) U18.43(GND) Y6.2 Y6.4 ; also sheet 1,2,3,4,5,6,7,8,10,11,12
N$78: C121.P$2 U18.16(XTAL2) Y6.3
N$79: C116.P$2 U18.17(XTAL1) Y6.1
N$80: J36.5 J37.6 R94.P$1 R95.P$2 U18.13(!RESET)
N$81: J37.1 U18.39(PF4/TCK)
N$82: J37.5 U18.38(PF5/TMS)
N$83: J37.3 U18.37(PF6/TDO)
N$84: J37.9 U18.36(PF7/TDI)
N$85: J40.C(SIG) M2.9(ANT)
N$86: J36.1 M2.2(MISO) U18.11(PB3/MISO)
N$87: J36.4 M2.3(MOSI) U18.10(PB2/MOSI)
N$88: J36.3 M2.4(SCK) U18.9(PB1/SCL)
N$89: J38.1 M2.6(RESET) R98.P$1
N$90: R98.P$2 U18.25(PD4)
N$91: J39.1 U18.21(PD3/TXD1)
N$92: J39.2 U18.20(PD2/RXD1)
N$93: J36.2 R97.P$2
N$94: M2.5(NSS) U18.28(PB4)
N$95: M2.16(DIO2) U18.29(PB5)
N$96: M2.11(DIO3) U18.30(PB6)
N$97: M2.12(DIO4) U18.12(PB7/!RTS)
N$98: M2.7(DIO5) U18.18(PD0/SCL)
N$99: M2.14(DIO0) U18.1(PE6)
N$100: M2.15(DIO1) U18.8(PB0/SS)
N$101: R96.P$2 U18.32(PC7)
N$102: D11.A R96.P$1
USB23_DN1_D_N [USB]: U18.3(D-) ; also sheet 6
USB23_DN1_D_P [USB]: U18.4(D+) ; also sheet 6
Unconnected: J37.7 J37.8 U18.2(UVCC) U18.19(PD1/SDA) U18.22(PD5/!CTS) U18.26(PD6) U18.27(PD7) U18.31(PC6) U18.40(PF1/ADC1) U18.41(PF0/ADC0) U18.42(AREF)

### Notes on the sheet
- N.C.
- N.C. | N.C.
- N.C.
- N.C. | AVR JTAG
- N.C.
- N.C.
- N.C.
- N.C.
- (Red)
- N.C.
- R-Pi Basestation
  Radio channel 2
- 1
- CTT-20190123S

## Sheet 10 of 12
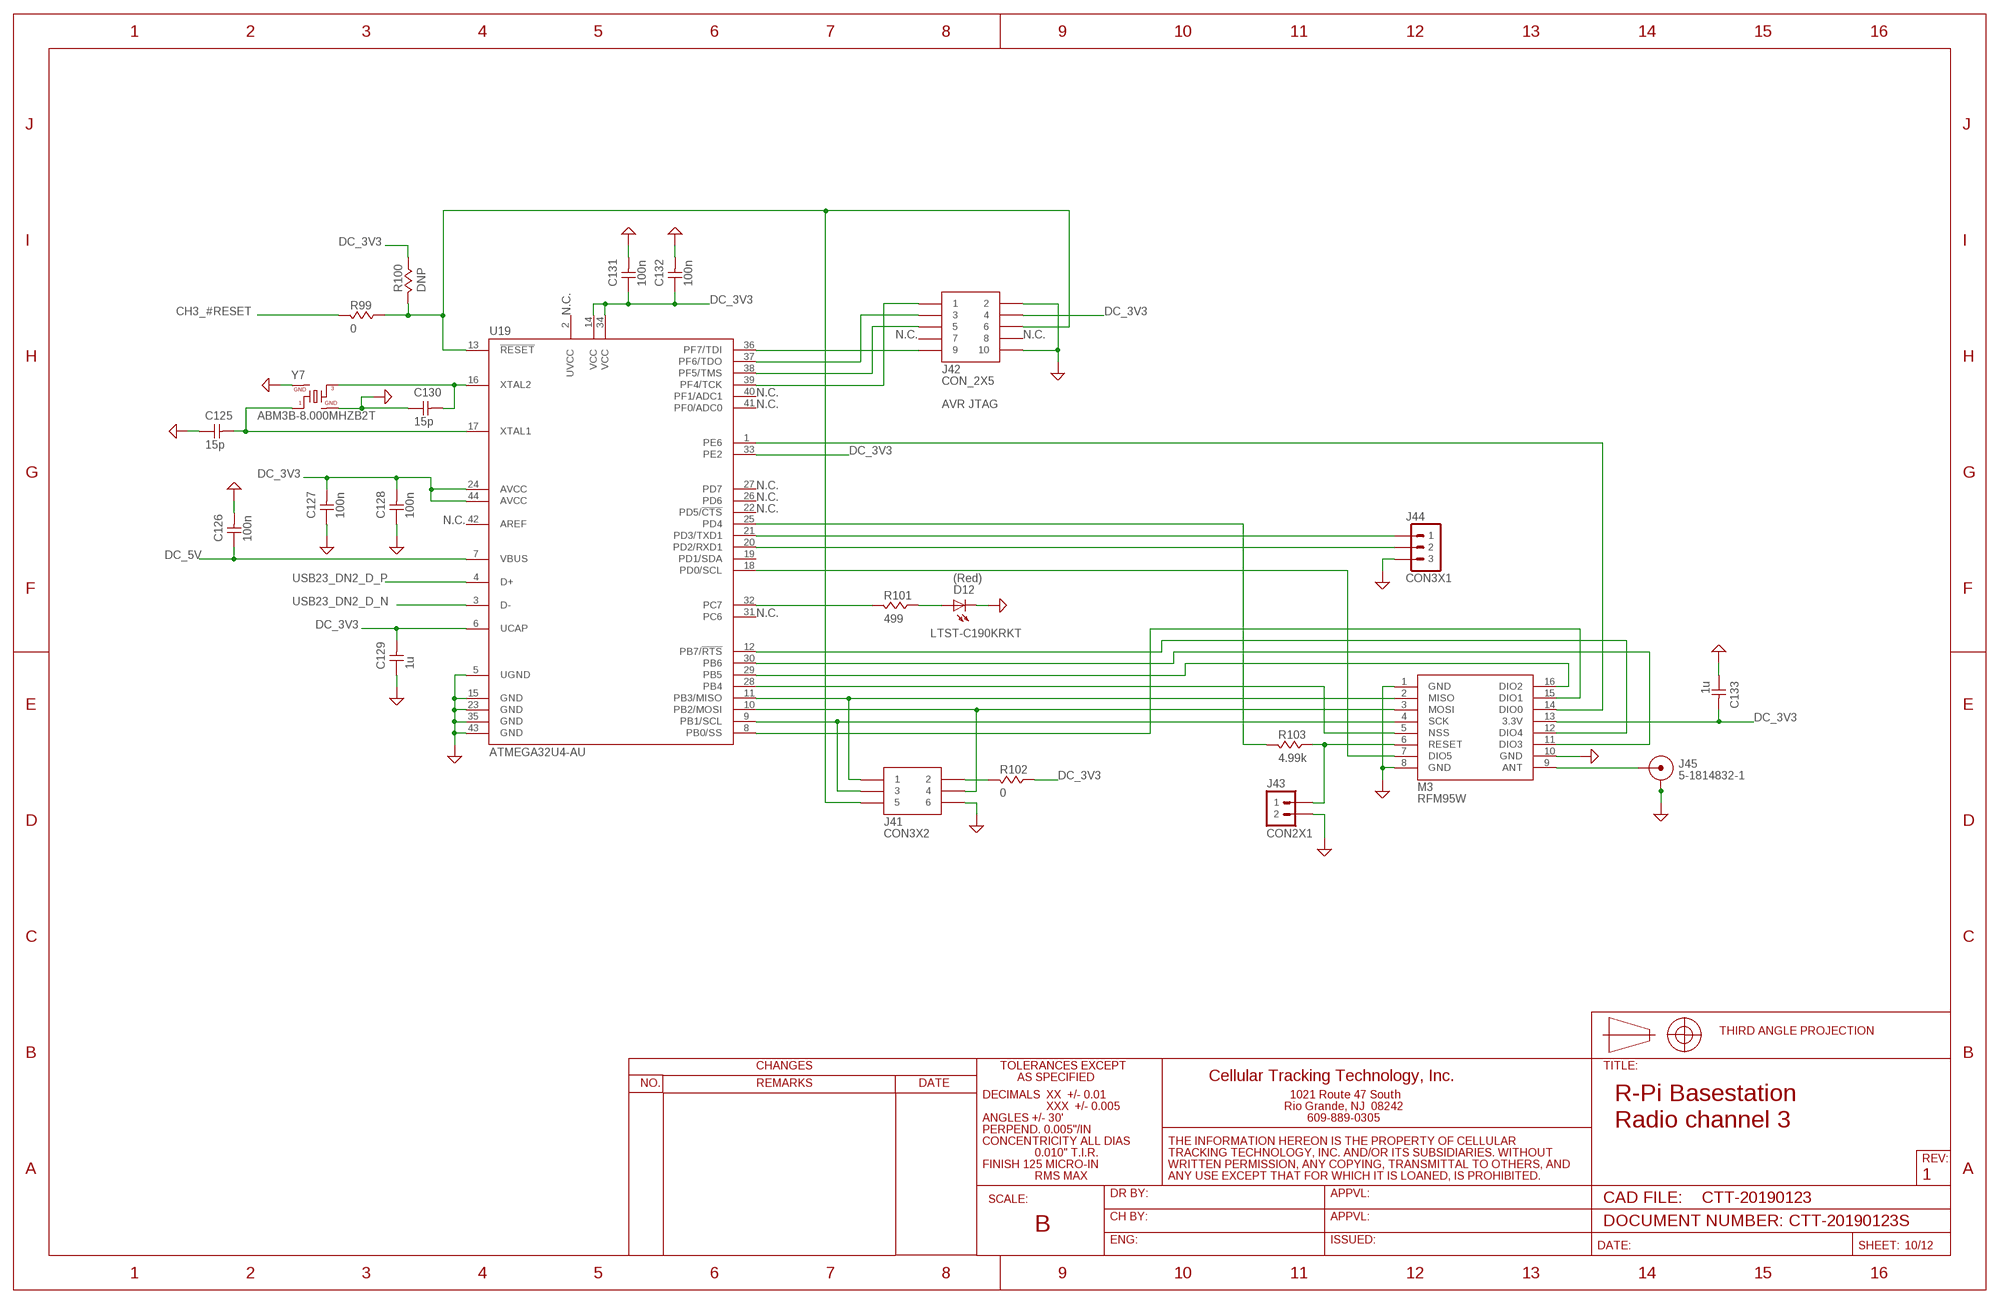
[diagram p9: schematic, sheet 10]

### Parts
C125  15p  C0402IPC_MED  [C0402_IPC7351_MED]
C126  100n  C0402IPC_MED  [C0402_IPC7351_MED]
C127  100n  C0402IPC_MED  [C0402_IPC7351_MED]
C128  100n  C0402IPC_MED  [C0402_IPC7351_MED]
C129  1u  C0603_IPC7351_MED  [C0603_IPC7351_MED]
C130  15p  C0402IPC_MED  [C0402_IPC7351_MED]
C131  100n  C0402IPC_MED  [C0402_IPC7351_MED]
C132  100n  C0402IPC_MED  [C0402_IPC7351_MED]
C133  1u  C0603_IPC7351_MED  [C0603_IPC7351_MED]
D12  LTST-C190KRKT  LTST-C190GKT  [LED0603]
J41  CON3X2  [CON3X2]
J42  CON_2X5  [CON_5X2]
J43  CON2X1  [CON2X1]
J44  CON3X1  [CON3X1]
J45  5-1814832-1  CON_COAXSMA_TH_VERT  [CON_SMA_TH_VERT]
M3  RFM95W  [RFM95W]
R99  0  R0402MED  [R0402_IPC7351_MED]
R100  DNP  R0402MED  [R0402_IPC7351_MED]
R101  499  R0402MED  [R0402_IPC7351_MED]
R102  0  R0402MED  [R0402_IPC7351_MED]
R103  4.99k  R0402MED  [R0402_IPC7351_MED]
U19  ATMEGA32U4-AU  [TQFP44]
Y7  ABM3B-8.000MHZB2T  [ABM3B]

### Nets
CH3_#RESET: R99.P$2 ; also sheet 2
DC_3V3: C127.P$2 C128.P$2 C129.P$2 C131.P$1 C132.P$1 C133.P$2 J42.4 M3.13(3.3V) R100.P$1 R102.P$1 U19.6(UCAP) U19.14(VCC) U19.24(AVCC) U19.33(PE2) U19.34(VCC) U19.44(AVCC) ; also sheet 1,2,3,4,5,6,7,8,9,11,12
DC_5V: C126.P$1 U19.7(VBUS) ; also sheet 1,2,3,4,5,7,8,9,11,12
GND: C125.P$1 C126.P$2 C127.P$1 C128.P$1 C129.P$1 C130.P$1 C131.P$2 C132.P$2 C133.P$1 D12.K J41.6 J42.2 J42.10 J43.2 J44.3 J45.P$1(GND) J45.P$2(GND) J45.P$3(GND) J45.P$4(GND) M3.1(GND) M3.8(GND) M3.10(GND) U19.5(UGND) U19.15(GND) U19.23(GND) U19.35(GND) U19.43(GND) Y7.2 Y7.4 ; also sheet 1,2,3,4,5,6,7,8,9,11,12
N$113: C130.P$2 U19.16(XTAL2) Y7.3
N$128: C125.P$2 U19.17(XTAL1) Y7.1
N$130: J41.5 J42.6 R99.P$1 R100.P$2 U19.13(!RESET)
N$131: J42.1 U19.39(PF4/TCK)
N$133: J42.5 U19.38(PF5/TMS)
N$135: J42.3 U19.37(PF6/TDO)
N$136: J42.9 U19.36(PF7/TDI)
N$137: J45.C(SIG) M3.9(ANT)
N$139: J41.1 M3.2(MISO) U19.11(PB3/MISO)
N$140: J41.4 M3.3(MOSI) U19.10(PB2/MOSI)
N$141: J41.3 M3.4(SCK) U19.9(PB1/SCL)
N$142: J43.1 M3.6(RESET) R103.P$1
N$143: R103.P$2 U19.25(PD4)
N$144: J44.1 U19.21(PD3/TXD1)
N$145: J44.2 U19.20(PD2/RXD1)
N$146: J41.2 R102.P$2
N$147: M3.5(NSS) U19.28(PB4)
N$148: M3.16(DIO2) U19.29(PB5)
N$149: M3.11(DIO3) U19.30(PB6)
N$150: M3.12(DIO4) U19.12(PB7/!RTS)
N$151: M3.7(DIO5) U19.18(PD0/SCL)
N$152: M3.14(DIO0) U19.1(PE6)
N$153: M3.15(DIO1) U19.8(PB0/SS)
N$154: R101.P$2 U19.32(PC7)
N$155: D12.A R101.P$1
USB23_DN2_D_N [USB]: U19.3(D-) ; also sheet 6
USB23_DN2_D_P [USB]: U19.4(D+) ; also sheet 6
Unconnected: J42.7 J42.8 U19.2(UVCC) U19.19(PD1/SDA) U19.22(PD5/!CTS) U19.26(PD6) U19.27(PD7) U19.31(PC6) U19.40(PF1/ADC1) U19.41(PF0/ADC0) U19.42(AREF)

### Notes on the sheet
- N.C.
- N.C. | N.C.
- N.C.
- N.C. | AVR JTAG
- N.C.
- N.C.
- N.C.
- N.C.
- (Red)
- N.C.
- R-Pi Basestation
  Radio channel 3
- 1
- CTT-20190123S

## Sheet 11 of 12
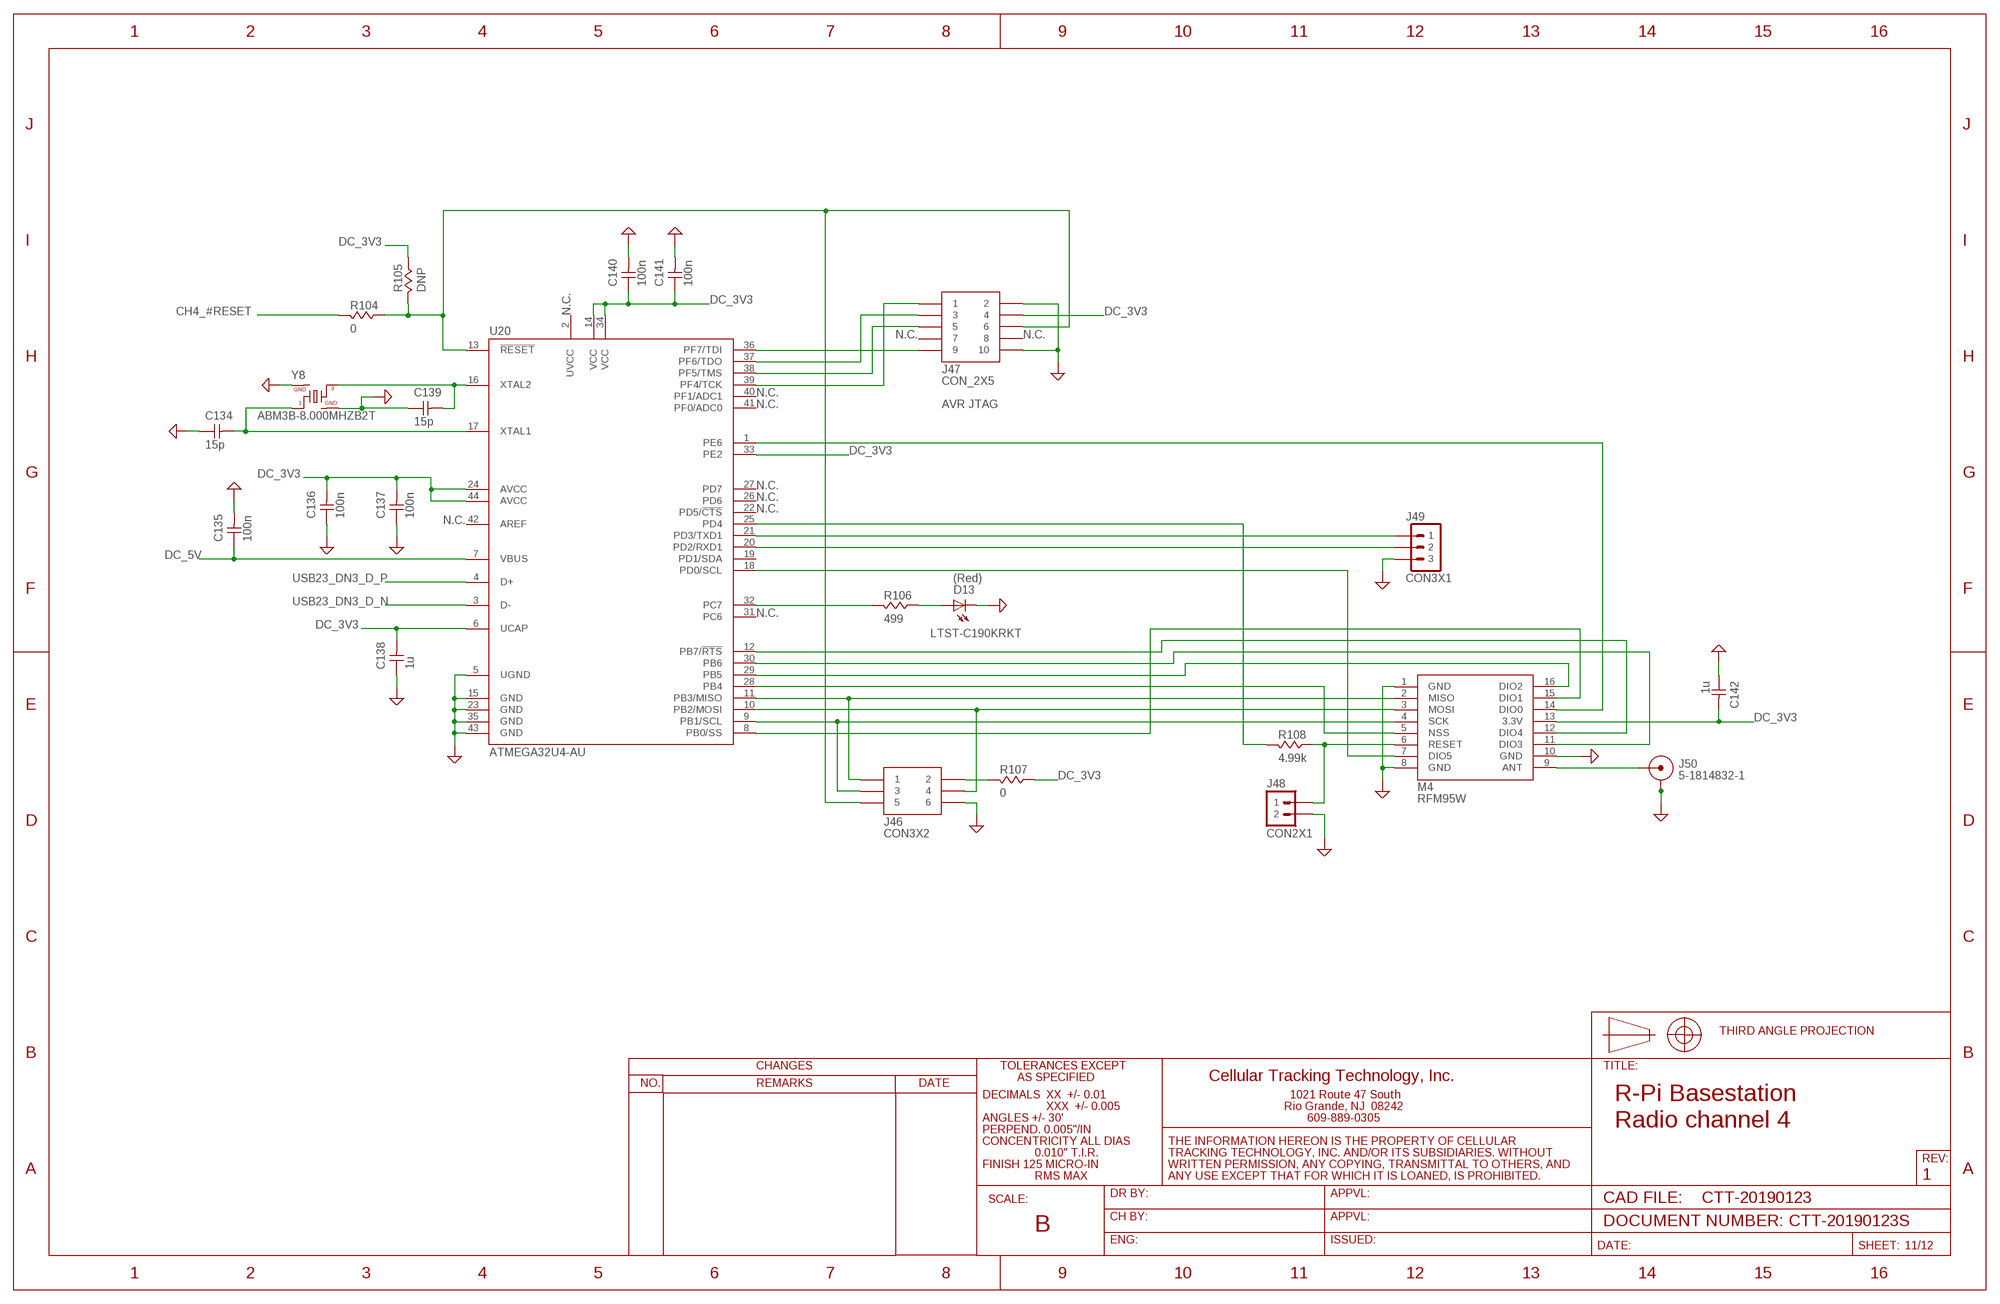
[diagram p10: schematic, sheet 11]

### Parts
C134  15p  C0402IPC_MED  [C0402_IPC7351_MED]
C135  100n  C0402IPC_MED  [C0402_IPC7351_MED]
C136  100n  C0402IPC_MED  [C0402_IPC7351_MED]
C137  100n  C0402IPC_MED  [C0402_IPC7351_MED]
C138  1u  C0603_IPC7351_MED  [C0603_IPC7351_MED]
C139  15p  C0402IPC_MED  [C0402_IPC7351_MED]
C140  100n  C0402IPC_MED  [C0402_IPC7351_MED]
C141  100n  C0402IPC_MED  [C0402_IPC7351_MED]
C142  1u  C0603_IPC7351_MED  [C0603_IPC7351_MED]
D13  LTST-C190KRKT  LTST-C190GKT  [LED0603]
J46  CON3X2  [CON3X2]
J47  CON_2X5  [CON_5X2]
J48  CON2X1  [CON2X1]
J49  CON3X1  [CON3X1]
J50  5-1814832-1  CON_COAXSMA_TH_VERT  [CON_SMA_TH_VERT]
M4  RFM95W  [RFM95W]
R104  0  R0402MED  [R0402_IPC7351_MED]
R105  DNP  R0402MED  [R0402_IPC7351_MED]
R106  499  R0402MED  [R0402_IPC7351_MED]
R107  0  R0402MED  [R0402_IPC7351_MED]
R108  4.99k  R0402MED  [R0402_IPC7351_MED]
U20  ATMEGA32U4-AU  [TQFP44]
Y8  ABM3B-8.000MHZB2T  [ABM3B]

### Nets
CH4_#RESET: R104.P$2 ; also sheet 2
DC_3V3: C136.P$2 C137.P$2 C138.P$2 C140.P$1 C141.P$1 C142.P$2 J47.4 M4.13(3.3V) R105.P$1 R107.P$1 U20.6(UCAP) U20.14(VCC) U20.24(AVCC) U20.33(PE2) U20.34(VCC) U20.44(AVCC) ; also sheet 1,2,3,4,5,6,7,8,9,10,12
DC_5V: C135.P$1 U20.7(VBUS) ; also sheet 1,2,3,4,5,7,8,9,10,12
GND: C134.P$1 C135.P$2 C136.P$1 C137.P$1 C138.P$1 C139.P$1 C140.P$2 C141.P$2 C142.P$1 D13.K J46.6 J47.2 J47.10 J48.2 J49.3 J50.P$1(GND) J50.P$2(GND) J50.P$3(GND) J50.P$4(GND) M4.1(GND) M4.8(GND) M4.10(GND) U20.5(UGND) U20.15(GND) U20.23(GND) U20.35(GND) U20.43(GND) Y8.2 Y8.4 ; also sheet 1,2,3,4,5,6,7,8,9,10,12
N$156: C139.P$2 U20.16(XTAL2) Y8.3
N$157: C134.P$2 U20.17(XTAL1) Y8.1
N$158: J46.5 J47.6 R104.P$1 R105.P$2 U20.13(!RESET)
N$159: J47.1 U20.39(PF4/TCK)
N$160: J47.5 U20.38(PF5/TMS)
N$161: J47.3 U20.37(PF6/TDO)
N$162: J47.9 U20.36(PF7/TDI)
N$163: J50.C(SIG) M4.9(ANT)
N$164: J46.1 M4.2(MISO) U20.11(PB3/MISO)
N$165: J46.4 M4.3(MOSI) U20.10(PB2/MOSI)
N$166: J46.3 M4.4(SCK) U20.9(PB1/SCL)
N$167: J48.1 M4.6(RESET) R108.P$1
N$171: R108.P$2 U20.25(PD4)
N$172: J49.1 U20.21(PD3/TXD1)
N$173: J49.2 U20.20(PD2/RXD1)
N$174: J46.2 R107.P$2
N$175: M4.5(NSS) U20.28(PB4)
N$176: M4.16(DIO2) U20.29(PB5)
N$177: M4.11(DIO3) U20.30(PB6)
N$178: M4.12(DIO4) U20.12(PB7/!RTS)
N$179: M4.7(DIO5) U20.18(PD0/SCL)
N$180: M4.14(DIO0) U20.1(PE6)
N$181: M4.15(DIO1) U20.8(PB0/SS)
N$182: R106.P$2 U20.32(PC7)
N$183: D13.A R106.P$1
USB23_DN3_D_N [USB]: U20.3(D-) ; also sheet 6
USB23_DN3_D_P [USB]: U20.4(D+) ; also sheet 6
Unconnected: J47.7 J47.8 U20.2(UVCC) U20.19(PD1/SDA) U20.22(PD5/!CTS) U20.26(PD6) U20.27(PD7) U20.31(PC6) U20.40(PF1/ADC1) U20.41(PF0/ADC0) U20.42(AREF)

### Notes on the sheet
- N.C.
- N.C. | N.C.
- N.C.
- N.C. | AVR JTAG
- N.C.
- N.C.
- N.C.
- N.C.
- (Red)
- N.C.
- R-Pi Basestation
  Radio channel 4
- 1
- CTT-20190123S

## Sheet 12 of 12
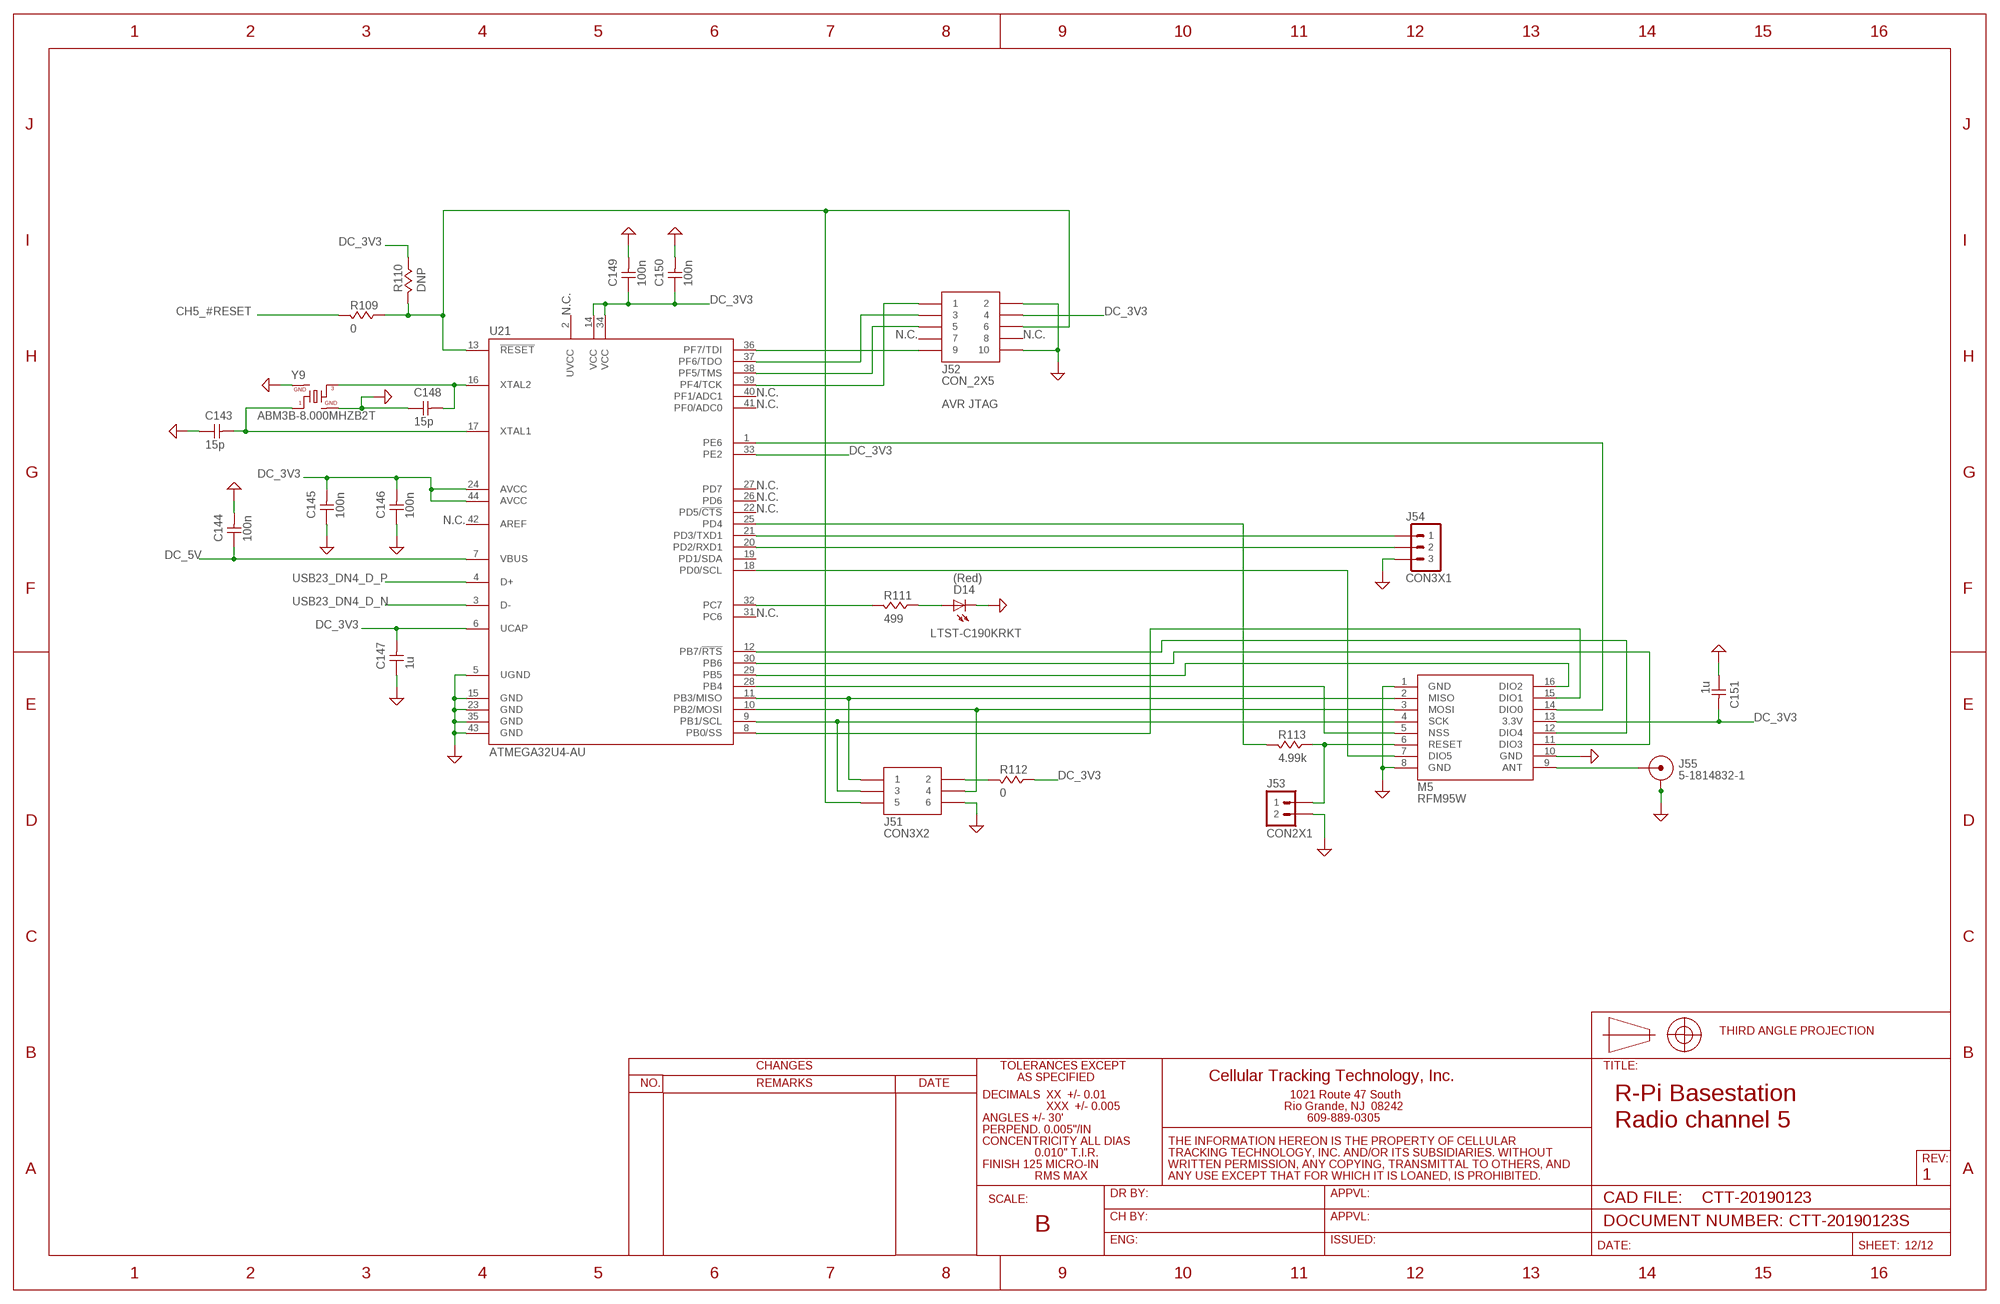
[diagram p11: schematic, sheet 12]

### Parts
C143  15p  C0402IPC_MED  [C0402_IPC7351_MED]
C144  100n  C0402IPC_MED  [C0402_IPC7351_MED]
C145  100n  C0402IPC_MED  [C0402_IPC7351_MED]
C146  100n  C0402IPC_MED  [C0402_IPC7351_MED]
C147  1u  C0603_IPC7351_MED  [C0603_IPC7351_MED]
C148  15p  C0402IPC_MED  [C0402_IPC7351_MED]
C149  100n  C0402IPC_MED  [C0402_IPC7351_MED]
C150  100n  C0402IPC_MED  [C0402_IPC7351_MED]
C151  1u  C0603_IPC7351_MED  [C0603_IPC7351_MED]
D14  LTST-C190KRKT  LTST-C190GKT  [LED0603]
J51  CON3X2  [CON3X2]
J52  CON_2X5  [CON_5X2]
J53  CON2X1  [CON2X1]
J54  CON3X1  [CON3X1]
J55  5-1814832-1  CON_COAXSMA_TH_VERT  [CON_SMA_TH_VERT]
M5  RFM95W  [RFM95W]
R109  0  R0402MED  [R0402_IPC7351_MED]
R110  DNP  R0402MED  [R0402_IPC7351_MED]
R111  499  R0402MED  [R0402_IPC7351_MED]
R112  0  R0402MED  [R0402_IPC7351_MED]
R113  4.99k  R0402MED  [R0402_IPC7351_MED]
U21  ATMEGA32U4-AU  [TQFP44]
Y9  ABM3B-8.000MHZB2T  [ABM3B]

### Nets
CH5_#RESET: R109.P$2 ; also sheet 2
DC_3V3: C145.P$2 C146.P$2 C147.P$2 C149.P$1 C150.P$1 C151.P$2 J52.4 M5.13(3.3V) R110.P$1 R112.P$1 U21.6(UCAP) U21.14(VCC) U21.24(AVCC) U21.33(PE2) U21.34(VCC) U21.44(AVCC) ; also sheet 1,2,3,4,5,6,7,8,9,10,11
DC_5V: C144.P$1 U21.7(VBUS) ; also sheet 1,2,3,4,5,7,8,9,10,11
GND: C143.P$1 C144.P$2 C145.P$1 C146.P$1 C147.P$1 C148.P$1 C149.P$2 C150.P$2 C151.P$1 D14.K J51.6 J52.2 J52.10 J53.2 J54.3 J55.P$1(GND) J55.P$2(GND) J55.P$3(GND) J55.P$4(GND) M5.1(GND) M5.8(GND) M5.10(GND) U21.5(UGND) U21.15(GND) U21.23(GND) U21.35(GND) U21.43(GND) Y9.2 Y9.4 ; also sheet 1,2,3,4,5,6,7,8,9,10,11
N$184: C148.P$2 U21.16(XTAL2) Y9.3
N$185: C143.P$2 U21.17(XTAL1) Y9.1
N$186: J51.5 J52.6 R109.P$1 R110.P$2 U21.13(!RESET)
N$187: J52.1 U21.39(PF4/TCK)
N$188: J52.5 U21.38(PF5/TMS)
N$189: J52.3 U21.37(PF6/TDO)
N$190: J52.9 U21.36(PF7/TDI)
N$191: J55.C(SIG) M5.9(ANT)
N$192: J51.1 M5.2(MISO) U21.11(PB3/MISO)
N$193: J51.4 M5.3(MOSI) U21.10(PB2/MOSI)
N$194: J51.3 M5.4(SCK) U21.9(PB1/SCL)
N$195: J53.1 M5.6(RESET) R113.P$1
N$196: R113.P$2 U21.25(PD4)
N$197: J54.1 U21.21(PD3/TXD1)
N$198: J54.2 U21.20(PD2/RXD1)
N$199: J51.2 R112.P$2
N$200: M5.5(NSS) U21.28(PB4)
N$201: M5.16(DIO2) U21.29(PB5)
N$202: M5.11(DIO3) U21.30(PB6)
N$203: M5.12(DIO4) U21.12(PB7/!RTS)
N$204: M5.7(DIO5) U21.18(PD0/SCL)
N$205: M5.14(DIO0) U21.1(PE6)
N$206: M5.15(DIO1) U21.8(PB0/SS)
N$207: R111.P$2 U21.32(PC7)
N$208: D14.A R111.P$1
USB23_DN4_D_N [USB]: U21.3(D-) ; also sheet 6
USB23_DN4_D_P [USB]: U21.4(D+) ; also sheet 6
Unconnected: J52.7 J52.8 U21.2(UVCC) U21.19(PD1/SDA) U21.22(PD5/!CTS) U21.26(PD6) U21.27(PD7) U21.31(PC6) U21.40(PF1/ADC1) U21.41(PF0/ADC0) U21.42(AREF)

### Notes on the sheet
- N.C.
- N.C. | N.C.
- N.C.
- N.C. | AVR JTAG
- N.C.
- N.C.
- N.C.
- N.C.
- (Red)
- N.C.
- R-Pi Basestation
  Radio channel 5
- 1
- CTT-20190123S